# Altium project SSB23_rev0.PrjPCB
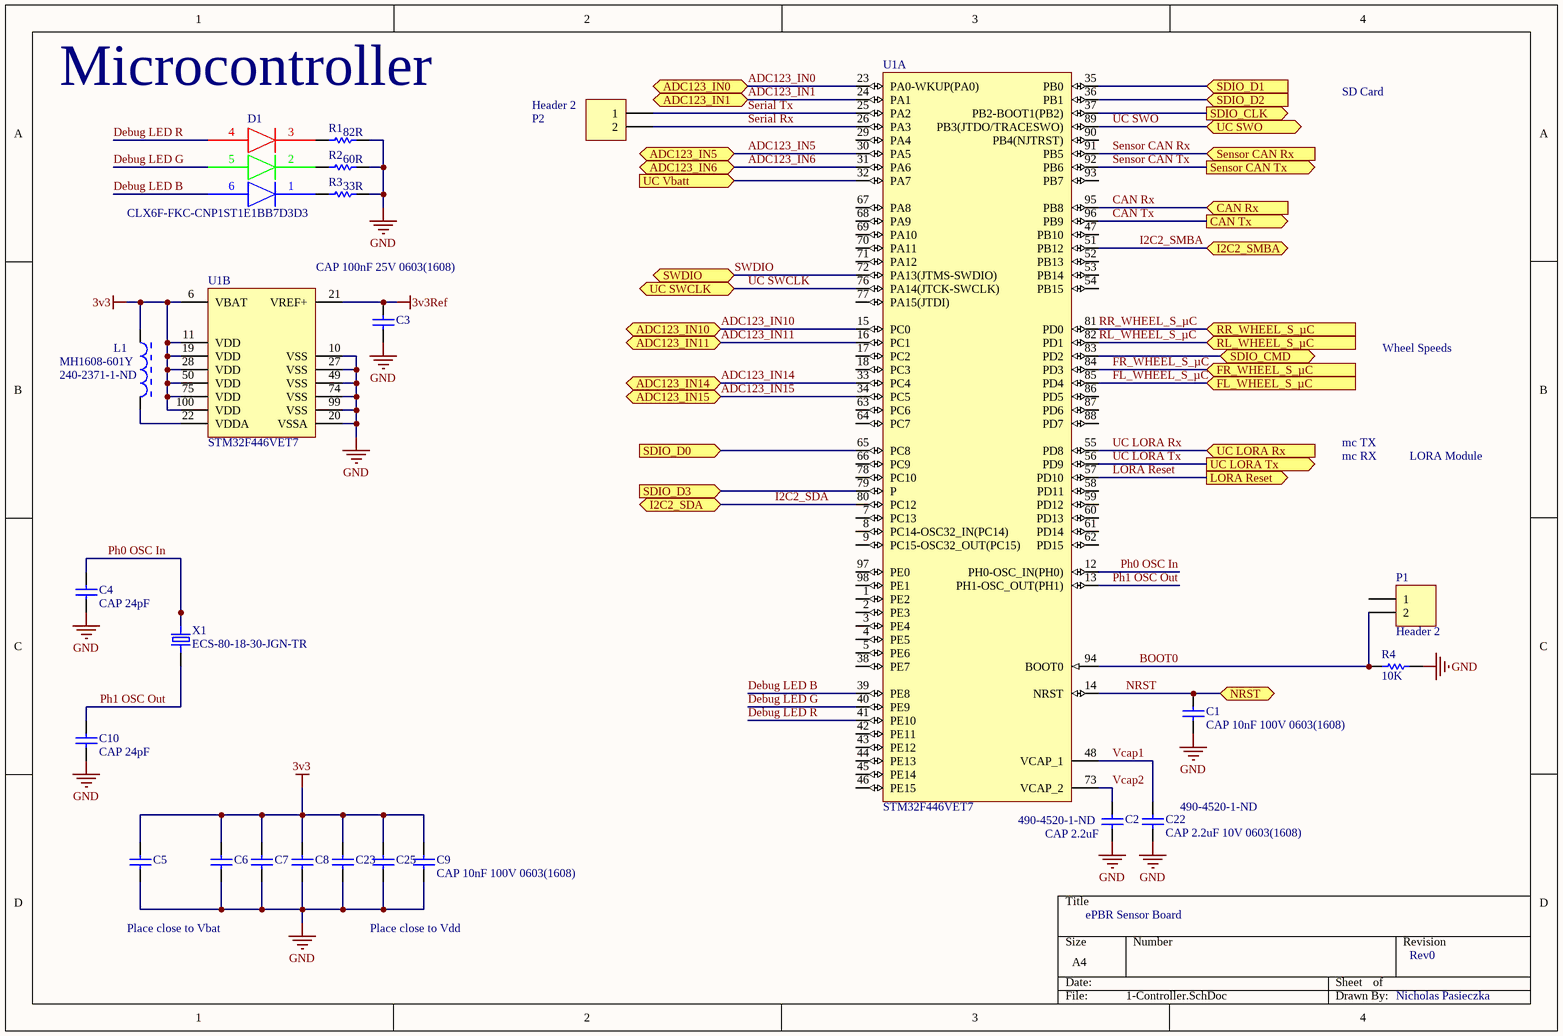
[diagram p0: 1-Controller.SchDoc]
8 sheets, 91 parts. Net scope: flat (ports and power ports of the same name join across sheets).
Board file: SSB23_rev0.PcbDoc
Sheets:
  1-Controller.SchDoc
  2-Power.SchDoc
  3-CAN.SchDoc
  4-Connector.SchDoc
  5-LORA.SchDoc
  6-Sensors.SchDoc
  7-Fusing.SchDoc
  8-Other_Inputs.SchDoc

## Sheet 1-Controller.SchDoc
size A4

### Parts
C1  CAP 10nF 100V 0603(1608)  [CAPC0603(1608)100_M]
C2  CAP 2.2uF  Supplier Part Number 1: 490-4520-1-ND  [CAPC0603(1608)55_N]
C3  CAP 100nF 25V 0603(1608)  [CAPC0603(1608)100_N]
C4  CAP 24pF  [CAPC0603(1608)100_N]
C5  CAP 10nF 100V 0603(1608)  [CAPC0603(1608)100_M]  (value not drawn)
C6  CAP 10nF 100V 0603(1608)  [CAPC0603(1608)100_M]  (value not drawn)
C7  CAP 10nF 100V 0603(1608)  [CAPC0603(1608)100_M]  (value not drawn)
C8  CAP 10nF 100V 0603(1608)  [CAPC0603(1608)100_M]  (value not drawn)
C9  CAP 10nF 100V 0603(1608)  [CAPC0603(1608)100_M]
C10  CAP 24pF  [CAPC0603(1608)100_N]
C22  CAP 2.2uF 10V 0603(1608)  Supplier Part Number 1: 490-4520-1-ND  [CAPC0603(1608)55_N]
C23  CAP 10nF 100V 0603(1608)  [CAPC0603(1608)100_M]  (value not drawn)
C25  CAP 10nF 100V 0603(1608)  [CAPC0603(1608)100_M]  (value not drawn)
D1  CLX6F-FKC-CNP1ST1E1BB7D3D3  [CLX6C-FKB]
L1  MH1608-601Y  Supplier Part Number 1: 240-2371-1-ND  [BOUR-MH1608_V]
P1  Header 2  [HDR1X2]
P2  Header 2  [HDR1X2]
R1  82R  [RESC0603(1608)_N]
R2  60R  [RESC0603(1608)_N]
R3  33R  [RESC0603(1608)_N]
R4  10K  [RESC0603(1608)_N]
U1  STM32F446VET7  [STM-LQFP100_L]  (parts A,B of 2)
X1  ECS-80-18-30-JGN-TR  [XTAL_ECS-80-18-30-JGN-TR]

### Ports
ADC123_IN0 (bidir), ADC123_IN1 (bidir), ADC123_IN5 (bidir), ADC123_IN6 (bidir), ADC123_IN10 (bidir), ADC123_IN11 (bidir), ADC123_IN14 (bidir), ADC123_IN15 (bidir), CAN Rx (in), CAN Tx (out), FL_WHEEL_S_µC (in), FR_WHEEL_S_µC (in), I2C2_SDA (bidir), I2C2_SMBA (bidir), LORA Reset (out), NRST (bidir), RL_WHEEL_S_µC (in), RR_WHEEL_S_µC (in), SDIO_CLK (out), SDIO_CMD (bidir), SDIO_D0 (in), SDIO_D1 (in), SDIO_D2 (in), SDIO_D3 (in), Sensor CAN Rx (in), Sensor CAN Tx (out), SWDIO (bidir), UC LORA Rx (in), UC LORA Tx (out), UC SWCLK (bidir), UC SWO (bidir), UC Vbatt (in)

### Nets
3v3: C5.2 C6.2 C7.2 C8.2 C9.2 C23.2 C25.2 L1.1 U1.6(VBAT) U1.11(VDD) U1.19(VDD) U1.28(VDD) U1.50(VDD) U1.75(VDD) U1.100(VDD)
3v3Ref: C3.2 U1.21(VREF+)
GND: C1.1 C2.1 C3.1 C4.1 C5.1 C6.1 C7.1 C8.1 C9.1 C10.1 C22.1 C23.1 C25.1 R1.2 R2.2 R3.2 R4.2 U1.10(VSS) U1.20(VSSA) U1.27(VSS) U1.49(VSS) U1.74(VSS) U1.99(VSS)
ADC123_IN0: U1.23(PA0-WKUP(PA0)) ; port ADC123_IN0
ADC123_IN1: U1.24(PA1) ; port ADC123_IN1
ADC123_IN5: U1.30(PA5) ; port ADC123_IN5
ADC123_IN6: U1.31(PA6) ; port ADC123_IN6
ADC123_IN10: U1.15(PC0) ; port ADC123_IN10
ADC123_IN11: U1.16(PC1) ; port ADC123_IN11
ADC123_IN14: U1.33(PC4) ; port ADC123_IN14
ADC123_IN15: U1.34(PC5) ; port ADC123_IN15
BOOT0: P1.2 R4.1 U1.94(BOOT0)
CAN Rx: U1.95(PB8) ; port CAN Rx
CAN Tx: U1.96(PB9) ; port CAN Tx
Debug LED B: D1.6(B) U1.39(PE8)
Debug LED G: D1.5(G) U1.40(PE9)
Debug LED R: D1.4(R) U1.41(PE10)
FL_WHEEL_S_µC: U1.85(PD4) ; port FL_WHEEL_S_µC
FR_WHEEL_S_µC: U1.84(PD3) ; port FR_WHEEL_S_µC
I2C2_SDA: U1.80(PC12) ; port I2C2_SDA
I2C2_SMBA: U1.51(PB12) ; port I2C2_SMBA
LORA Reset: U1.57(PD10) ; port LORA Reset
NRST: C1.2 U1.14(NRST) ; port NRST
Ph0 OSC In: C4.2 U1.12(PH0-OSC_IN(PH0)) X1.2(OUT/IN)
Ph1 OSC Out: C10.2 U1.13(PH1-OSC_OUT(PH1)) X1.1(IN/OUT)
RL_WHEEL_S_µC: U1.82(PD1) ; port RL_WHEEL_S_µC
RR_WHEEL_S_µC: U1.81(PD0) ; port RR_WHEEL_S_µC
Sensor CAN Rx: U1.91(PB5) ; port Sensor CAN Rx
Sensor CAN Tx: U1.92(PB6) ; port Sensor CAN Tx
Serial Rx: P2.2 U1.26(PA3)
Serial Tx: P2.1 U1.25(PA2)
SWDIO: U1.72(PA13(JTMS-SWDIO)) ; port SWDIO
UC LORA Rx: U1.55(PD8) ; port UC LORA Rx
UC LORA Tx: U1.56(PD9) ; port UC LORA Tx
UC SWCLK: U1.76(PA14(JTCK-SWCLK)) ; port UC SWCLK
UC SWO: U1.89(PB3(JTDO/TRACESWO)) ; port UC SWO
UC Vbatt: U1.32(PA7) ; port UC Vbatt
Vcap1: C22.2 U1.48(VCAP_1)
Vcap2: C2.2 U1.73(VCAP_2)
NetCN1_1: U1.83(PD2) ; port SDIO_CMD
NetCN1_2: U1.79(P) ; port SDIO_D3
NetCN1_3: U1.65(PC8) ; port SDIO_D0
NetCN1_4: U1.35(PB0) ; port SDIO_D1
NetCN1_5: U1.36(PB1) ; port SDIO_D2
NetCN1_6: U1.37(PB2-BOOT1(PB2)) ; port SDIO_CLK
NetD1_1: D1.1(B) R3.1
NetD1_2: D1.2(G) R2.1
NetD1_3: D1.3(R) R1.1
NetL1_2: L1.2 U1.22(VDDA)

Not connected (* = marked no-connect by the designer): P1 1; U1 1(PE2) 2(PE3) 3(PE4) 4(PE5) 5(PE6) 7(PC13) 8(PC14-OSC32_IN(PC14)) 9(PC15-OSC32_OUT(PC15)) 17(PC2) 18(PC3) 29(PA4) 38(PE7) 42(PE11) 43(PE12) 44(PE13) 45(PE14) 46(PE15) 47(PB10) 52(PB13) 53(PB14) 54(PB15) 58(PD11) 59(PD12) 60(PD13) 61(PD14) 62(PD15) 63(PC6) 64(PC7) 66(PC9) 67(PA8) 68(PA9) 69(PA10) 70(PA11) 71(PA12) 77(PA15(JTDI)) 78(PC10) 86(PD5) 87(PD6) 88(PD7) 90(PB4(NJTRST)) 93(PB7) 97(PE0) 98(PE1)

### Notes on the sheet
- Microcontroller
- SD Card
- Wheel Speeds
- mc TX
- mc RX
- LORA Module
- ePBR Sensor Board
- Place close to Vbat
- Place close to Vdd
- Rev0
- Nicholas Pasieczka

### Library data of the parts
C1 C5-C9 C23 C25 = CMP-1035-02326-1: CAP 10nF 100V ±20% 0603 (1608 Metric) Thickness 1mm SMD; Case-EIA: 0603; Tolerance: Â±20%; Case-Metric: 1608; Max Thickness: 1 mm; Technology: SMT; Value: 10nF; Rated Voltage: 100 V
C2 C22 = CMP-1035-02757-1: CAP 2.2uF 10V ±10% 0603 (1608 Metric) Thickness 0.55mm SMD; Case-EIA: 0603; Case-Metric: 1608; Tolerance: Â±10%; Value: 2.2uF; Rated Voltage: 10 V; Technology: SMT; Max Thickness: 0.55 mm; Supplier 1: Digi-Key
C3 = CMP-1035-02589-1: CAP 100nF 25V ±20% 0603 (1608 Metric) Thickness 1mm SMD; Case-EIA: 0603; Tolerance: Â±20%; Case-Metric: 1608; Value: 100nF; Max Thickness: 1 mm; Technology: SMT; Rated Voltage: 25 V
C4 C10 = CMP-1035-00843-1: CAP 24pF 16V ±2% 0603 (1608 Metric) Thickness 1mm SMD; Tolerance: Â±2%; Case-Metric: 1608; Case-EIA: 0603; Value: 24pF; Technology: SMT; Rated Voltage: 16 V; Max Thickness: 1 mm
D1 = LED - CLX6F-FKC-CNP1ST1E1BB7D3D3: Red, Green, Blue (RGB) 622nm Red, 530nm Green, 470nm Blue LED Indication - Discrete 2.1V Red, 2.7V Green, 3V Blue 6-SMD, J-Lead; ComponentLink1Description: Digikey; ComponentLink1URL: https://www.digikey.ca/product-detail/en/cree-inc/CLX6F-FKC-CNP1ST1E1BB7D3D3/CLX6F-FKC-CNP1ST1E1BB7D3D3CT-ND/6362814
L1 = CMP-2000-06698-1: Chip Bead, 600 Ohm, 1 A, -55 to 125 degC, 2-Pin SMD (0603), RoHS, Tape and Reel; Manufacturer: Bourns; Impedance @ Frequency: 600Ohm@100MHz; Online Catalog: MHSeries; DC Resistance (DCR) (Max): 200mOhm; Current Rating (Max): 1A; Other Names: MH1608-601YCT; EDA / CAD Models: DownloadfromAcceleratedDesigns; Filter Type: Power,SignalLine; Number of Lines: 1; Mounting Type: SurfaceMount; Manufacturer URL: http://www.bourns.com/; Package Description: 2-Pin Surface Mount Device, Body 1.6 x 0.8 mm; Category: Filters; Packaging: CutTape(CT); Family: FerriteBeadsandChips; Datasheet Version: 03/2015; Standard Package: 1; Mounting Technology: SurfaceMount; Package / Case: 0603(1608Metric); Datasheet URL: http://www.bourns.com/docs/Product-Datasheets/mh.pdf; Operating Temperature: -55°C~125°C; RoHS Information: MH1608SeriesMaterialDeclaration; Ratings: -; Package Reference: 0603; Series: MH; Supplier 1: Digi-Key
P1 P2 = Header 2: Header, 2-Pin; LatestRevisionDate: 17-Jul-2002; LatestRevisionNote: Re-released for DXP Platform.; Publisher: Altium Limited
R1 = CMP-1012-00048-1: 82R 0.1W 5% 0603 (1608 Metric)  SMD; Case-Metric: 1608; Value: 82.00 Ohm; Case-EIA: 0603; Technology: SMT; Tolerance: 5 %; Power: 0.1 W
R2 = CMP-1012-00372-1: 60R4 0.1W 1% 0603 (1608 Metric)  SMD; Case-EIA: 0603; Value: 60.40 Ohm; Case-Metric: 1608; Technology: SMT; Tolerance: 1 %; Power: 0.1 W
R3 = CMP-1012-00038-1: 33R 0.1W 5% 0603 (1608 Metric)  SMD; Value: 33.00 Ohm; Case-EIA: 0603; Case-Metric: 1608; Tolerance: 5 %; Technology: SMT; Power: 0.1 W
R4 = CMP-1012-00098-1: 10K 0.1W 5% 0603 (1608 Metric)  SMD; Case-EIA: 0603; Value: 10000.00 Ohm; Case-Metric: 1608; Technology: SMT; Tolerance: 5 %; Power: 0.1 W
U1 = CMP-0243-00221-1: ARM Cortex-M4 32-bit MCU+FPU, 512 KB Flash, 128 KB Internal RAM, 81 I/Os, 100-Pin LQFP, -40 to 105 degC, Tray; Supply Voltage(Vcc) min (V): 1.7; Operating Frequency(F) (Processor speed) (MHz): 180; D/A Converter: 2; FLASH Size (Prog) (kB): 512; I/Os (High Current): 81; Internal RAM Size (kB): 128; Core: ARM Cortex-M4; Packing: Tray; ComponentLink1URL: http://www.st.com/; DatasheetVersion: Rev. 6; Mounting Technology: Surface Mount; ComponentLink2Description: Datasheet; ComponentLink2URL: http://www.st.com/st-web-ui/static/active/en/resource/technical/document/datasheet/DM00141306.pdf; Package Reference: 100-Pin Low Profile Quad Flat Package, Body 14 x 14 mm, Pitch 0.5 mm; ComponentLink1Description: Manufacturer URL; Package Description: LQFP100; PartId: 1
X1 = ECS-80-18-30-JGN-TR: 8MHz Â±20ppm Crystal 18pF 100 Ohms 2-SMD, No Lead; MF: ECS Inc.; Digi-Key_Part_Number: XC2103CT-ND; Digi-Key_Purchase_URL: https://www.digikey.com/product-detail/en/ecs-inc/ECS-80-18-30-JGN-TR/XC2103CT-ND/5875587?utm_source=snapeda&utm_medium=aggregator&utm_campaign=symbol; SnapEDA_Link: https://www.snapeda.com/parts/ECS-80-18-30-JGN-TR/ECS%20Inc./view-part/2121425/?ref=snap; Package: SMD-2 ECS International; MP: ECS-80-18-30-JGN-TR; Value: *

## Sheet 2-Power.SchDoc
size A4
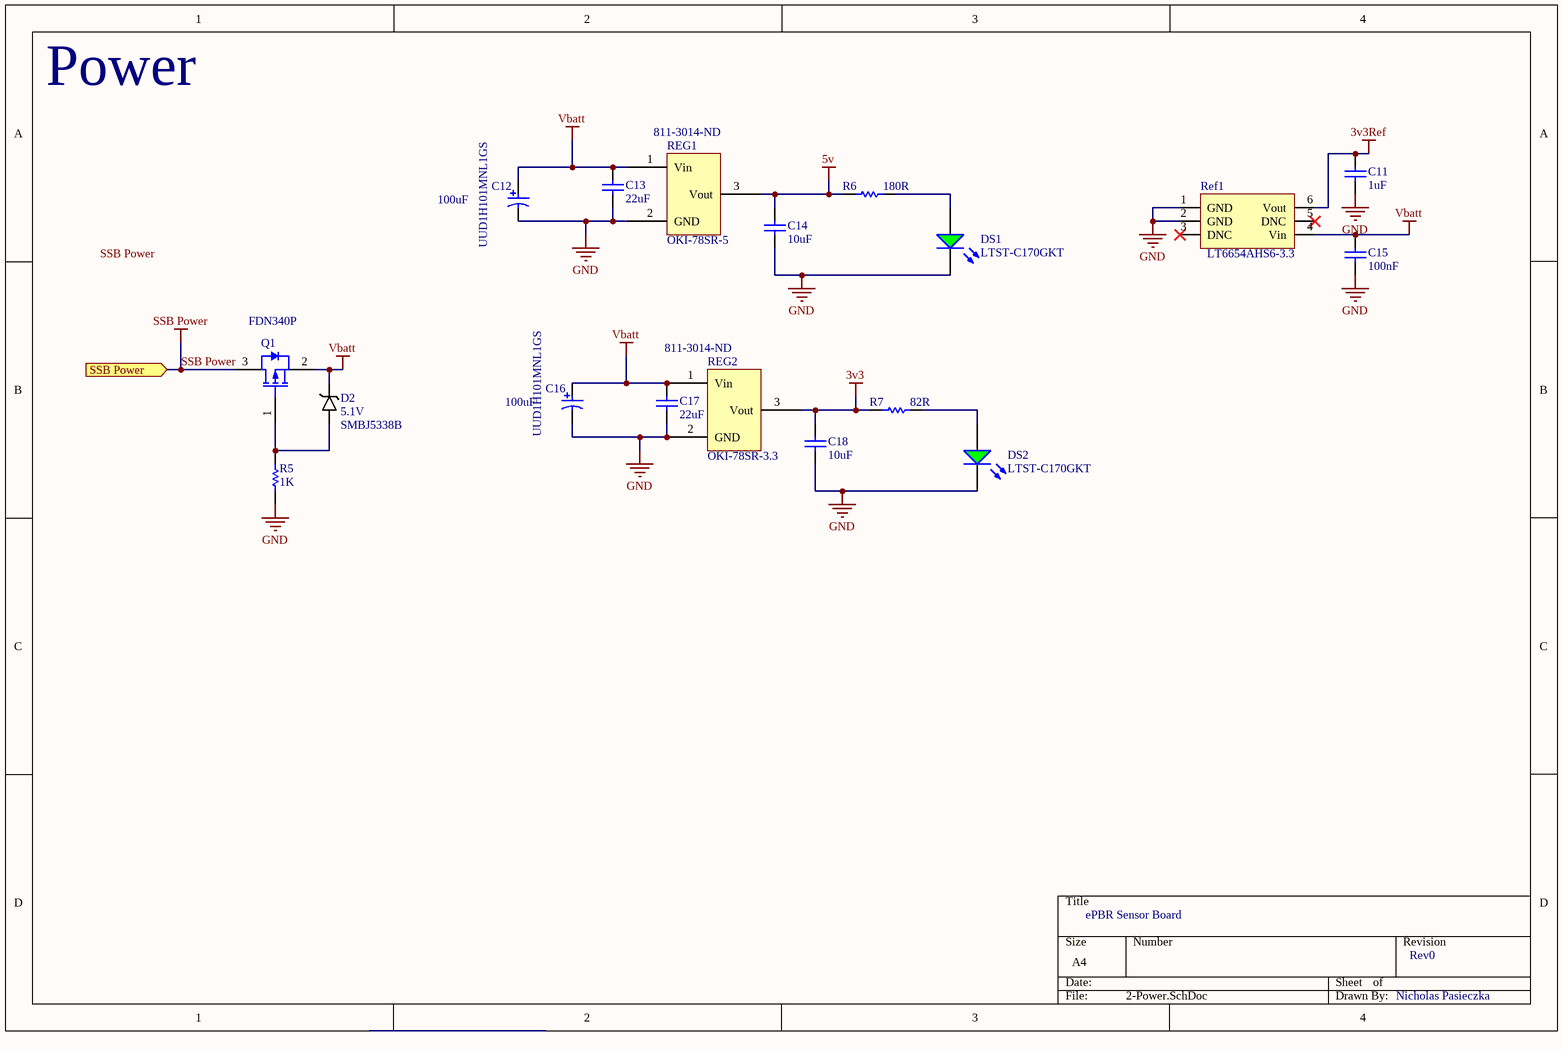
[diagram p1: 2-Power.SchDoc]

### Parts
C11  value 1uF  [1608[0603]]  (hidden comment: Cap)
C12  UUD1H101MNL1GS  [NIC-CAPA2-8X10_V]
C13  value 22uF  [C1210_M]  (hidden comment: Cap)
C14  value 10uF  [C1210_M]  (hidden comment: Cap)
C15  value 100nF  [1608[0603]]  (hidden comment: Cap)
C16  UUD1H101MNL1GS  [NIC-CAPA2-8X10_V]
C17  value 22uF  [C1210_M]  (hidden comment: Cap)
C18  value 10uF  [C1210_M]  (hidden comment: Cap)
D2  Reverse Voltage: 5.1V  Part Number: SMBJ5338B  [DO-214AA (SMB)]  (hidden comment: Zener Diode, 5.1V, 5W SMBJ5338B)
DS1  LTST-C170GKT  [LTST-C170GKT_V]
DS2  LTST-C170GKT  [LTST-C170GKT_V]
Q1  FDN340P  [FAIR-SSOT3L-3_V]
R5  value 1K  [1608[0603]]  (hidden comment: Res1)
R6  value 180R  [1608[0603]]  (hidden comment: Res1)
R7  value 82R  [1608[0603]]  (hidden comment: Res1)
Ref1  LT6654AHS6-3.3  [TSOT-23 S6]
REG1  OKI-78SR-5  Supplier Part Number 2: 811-3014-ND  [OKI-78SR-5/1.5-W - Horizontal]
REG2  OKI-78SR-3.3  Supplier Part Number 2: 811-3014-ND  [Reg - TH, 3 pin, 100 mil Pitch, VTL]

### Ports
SSB Power (in)

### Nets
3v3: C18.2 R7.1 REG2.3(Vout)
3v3Ref: C11.2 Ref1.6(Vout)
5v: C14.2 R6.1 REG1.3(Vout)
GND: C11.1 C12.2 C13.1 C14.1 C15.1 C16.2 C17.1 C18.1 DS1.2(K) DS2.2(K) R5.1 Ref1.1(GND) Ref1.2(GND) REG1.2(GND) REG2.2(GND)
SSB Power: Q1.3(DRAIN) ; port SSB Power
Vbatt: C12.1 C13.2 C15.2 C16.1 C17.2 D2.K Q1.2(SOURCE) Ref1.4(Vin) REG1.1(Vin) REG2.1(Vin)
NetD2_A: D2.A Q1.1(GATE) R5.2
NetDS1_1: DS1.1(A) R6.2
NetDS2_1: DS2.1(A) R7.2

Not connected (* = marked no-connect by the designer): Ref1 3(DNC)* 5(DNC)*

### Notes on the sheet
- Power
- (near C12) 100uF
- (near C16) 100uF
- ePBR Sensor Board
- Rev0
- Nicholas Pasieczka
- Labels drawn without touching a wire or pin: SSB Power

### Library data of the parts
C11 = Cap: Capacitor; Manufacturer: Murata Electronics North America; Manufacturer Part Number: GRM188R61E105KA12D; Capacitance: 1µF; Tolerance: ±10%; Voltage - Rated: 25V; Temperature Coefficient: X5R; Supplier 1: Digi-Key; Supplier Part Number 1: 490-3897-1-ND; RoHS: RoHS Compliant; Category: Capacitors; Stock 1: 4259407; Pricing 1: 1=0.15, 10=0.053, 50=0.0288, 100=0.0242, 250=0.01984, 500=0.01696, 1000=0.0132 (CAD); Packaging: Cut Tape (CT); Part Status: Active; Operating Temperature: -55°C ~ 85°C; Features: -; Ratings: -; Applications: General Purpose; Mounting Type: Surface Mount, MLCC; Package / Case: 0603 (1608 Metric); Size / Dimension: 0.063" L x 0.031" W (1.60mm x 0.80mm); Height - Seated (Max): -; Thickness (Max): 0.035" (0.90mm); Lead Spacing: -; Lead Style: -; ComponentLink1URL: http://www.murata.com/~/media/webrenewal/support/library/catalog/products/capacitor/mlcc/c02e.pdf; ComponentLink1Description: http://www.murata.com/~/media/webrenewal/support/library/catalog/products/capacitor/mlcc/c02e.pdf
C12 C16 = CMP-0687-00073-1: Aluminum Electrolytic Capacitor, UD Series, Low Impedance, 100 uF, 50 V, + / - 20%, -55 to 105 degC, Chip Type, 8 x 10 mm D x L, Pb-Free, Reel; Manufacturer: Nichicon; Rated Ripple Current (at 100kHz): 300 mA; Tolerance Rated Capacitance: -20 to 20%; Packing: Dia382mm Reel; Impedance: 0.34 Ohm; Rated Voltage: 50 V; Endurance Time: 5000 h; Rated Capacitance: 100 uF; Capacitance: 100µF; Voltage Rating: 50V; Lifetime @ Temp.: 5000 Hrs @ 105°C; Polarization: Polar; Ripple Current: 300mA; Surface Mount Land Size: 0.327" L x 0.327" W (8.30mm x 8.30mm); ComponentLink3Description: Package Specification; ComponentLink2Description: Datasheet; PackageReference: CAPAE-D8H10; RoHS: TRUE; Length: 10 mm; Mounting Technology: Surface Mount; PackageDescription: 2-Pin Surface Mount Device, Diameter 8 mm, Height 10 mm, Pitch 6.5 mm; DatasheetVersion: 08/2012; Diameter: 8 mm; ComponentLink3URL: http://products.nichicon.co.jp/en/pdf/XJA043/e-ud.pdf; ComponentLink1Description: Manufacturer URL; PartNumber: UUD1H101MNL1GS; ComponentLink2URL: http://products.nichicon.co.jp/en/pdf/XJA043/e-ud.pdf; ComponentLink1URL: http://www.nichicon.co.jp/; Supplier 1: Digi-Key; Supplier Part Number 1: 493-2306-1-ND; Manufacturer Part Number: UUD1H101MNL1GS; Category: Capacitors; Stock 1: 65948; Pricing 1: 1=0.92, 10=0.685, 25=0.5868, 50=0.5478, 100=0.4696, 250=0.43044 (CAD); Packaging: Cut Tape (CT); Part Status: Active; Tolerance: ±20%; ESR (Equivalent Series Resistance): -; Operating Temperature: -55°C ~ 105°C; Applications: General Purpose; Lead Spacing: -; Size / Dimension: 0.315" Dia (8.00mm); Height - Seated (Max): 0.394" (10.00mm); Mounting Type: Surface Mount; Package / Case: Radial, Can - SMD; ComponentLink4URL: http://nichicon-us.com/english/products/pdfs/e-uud.pdf; ComponentLink4Description: http://nichicon-us.com/english/products/pdfs/e-uud.pdf
C13 C17 = Cap: Capacitor; Manufacturer: Yageo; Manufacturer Part Number: CC1210MKX5R8BB226; Capacitance: 22µF; Tolerance: ±20%; Voltage - Rated: 25V; Temperature Coefficient: X5R; Supplier 1: Digi-Key; Supplier Part Number 1: 311-2056-1-ND; RoHS: RoHS Compliant; Category: Capacitors; Stock 1: 128; Pricing 1: 1=1, 10=0.703, 25=0.5996, 50=0.5314, 100=0.4628, 250=0.39424 (CAD); Packaging: Cut Tape (CT); Part Status: Active; Operating Temperature: -55°C ~ 85°C; Features: -; Ratings: -; Applications: General Purpose; Failure Rate: -; Mounting Type: Surface Mount, MLCC; Package / Case: 1210 (3225 Metric); Size / Dimension: 0.126" L x 0.098" W (3.20mm x 2.50mm); Height - Seated (Max): -; Thickness (Max): 0.110" (2.80mm); Lead Spacing: -; Lead Style: -; ComponentLink1URL: http://www.yageo.com/documents/recent/UPY-GPHC_X5R_4V-to-50V_23.pdf; ComponentLink1Description: http://www.yageo.com/documents/recent/UPY-GPHC_X5R_4V-to-50V_23.pdf
C14 C18 = Cap: Capacitor; Manufacturer: Yageo; Manufacturer Part Number: CC1210ZKY5V8BB106; Capacitance: 10µF; Tolerance: -20%, +80%; Voltage - Rated: 25V; Temperature Coefficient: Y5V (F); Supplier 1: Digi-Key; Supplier Part Number 1: 311-2063-1-ND; RoHS: RoHS Compliant; Category: Capacitors; Stock 1: 1156; Pricing 1: 1=0.47, 10=0.323, 25=0.258, 50=0.2154, 100=0.1829, 250=0.14528, 500=0.12912, 1000=0.11298 (CAD); Packaging: Cut Tape (CT); Part Status: Active; Operating Temperature: -30°C ~ 85°C; Features: -; Ratings: -; Applications: General Purpose; Failure Rate: -; Mounting Type: Surface Mount, MLCC; Package / Case: 1210 (3225 Metric); Size / Dimension: 0.126" L x 0.098" W (3.20mm x 2.50mm); Height - Seated (Max): -; Thickness (Max): 0.083" (2.10mm); Lead Spacing: -; Lead Style: -; ComponentLink1URL: http://www.yageo.com/documents/recent/UPY-GPHC_Y5V_6.3V-to-50V_7.pdf; ComponentLink1Description: http://www.yageo.com/documents/recent/UPY-GPHC_Y5V_6.3V-to-50V_7.pdf
C15 = Cap: Capacitor; Manufacturer: Yageo; Manufacturer Part Number: CC0603KRX7R9BB104; Capacitance: 0.10µF; Tolerance: ±10%; Voltage - Rated: 50V; Temperature Coefficient: X7R; Supplier 1: Digi-Key; Supplier Part Number 1: 311-1344-1-ND; RoHS: RoHS Compliant; Category: Capacitors; Stock 1: 4016262; Pricing 1: 1=0.15, 10=0.043, 25=0.0312, 50=0.0232, 100=0.0189, 250=0.0158, 500=0.01346, 1000=0.01059 (CAD); Packaging: Cut Tape (CT); Part Status: Active; Operating Temperature: -55°C ~ 125°C; Features: -; Ratings: -; Applications: General Purpose; Failure Rate: -; Mounting Type: Surface Mount, MLCC; Package / Case: 0603 (1608 Metric); Size / Dimension: 0.063" L x 0.031" W (1.60mm x 0.80mm); Height - Seated (Max): -; Thickness (Max): 0.035" (0.90mm); Lead Spacing: -; Lead Style: -; ComponentLink1URL: http://www.yageo.com/documents/recent/UPY-GPHC_X7R_6.3V-to-50V_16.pdf; ComponentLink1Description: http://www.yageo.com/documents/recent/UPY-GPHC_X7R_6.3V-to-50V_16.pdf
DS1 DS2 = CMP-1674-00002-5: LED Uni-Color Green, 100 mW, 120 mA, -55 to 85 degC, 2-Pin SMD, RoHS, Tape and Reel; Manufacturer: Lite-On; Lens Color: Colorless; Lens Transparency: Clear; Millicandela Rating: 6mcd; Lens Style/Size: Rectangle with Flat Top, 1.40mm x 1.25mm; Voltage - Forward (Vf) (Typ): 2.1V; Current - Test: 10mA; Viewing Angle: 130°; Wavelength - Dominant: 569nm; Wavelength - Peak: 565nm; ComponentLink1URL: http://www.us.liteon.com/; Height: 1.1 mm; PackageDescription: 2-Pin Surface Mount Device, Body 2 x 1.25 mm; RoHSCompliant: true; Package Quantity: 1; Packaging: Tape and Reel; Mount: Surface Mount; Min Operating Temperature: -55 degC; DatasheetVersion: 03/2003; Max Operating Temperature: 85 degC; ComponentLink1Description: Manufacturer URL; Pins: 2; Mounting Technology: Surface Mount; Length: 2 mm; Colour: Green; PackageReference: C170GKT; ComponentLink2URL: http://media.digikey.com/pdf/Data%20Sheets/Lite-On%20PDFs/LTST-C170GKT.pdf; ComponentLink2Description: Datasheet; Supplier 1: Digi-Key; Supplier Part Number 1: 160-1179-1-ND; Manufacturer Part Number: LTST-C170GKT; RoHS: RoHS Compliant; Category: Optoelectronics; Stock 1: 242288; Pricing 1: 1=0.48, 10=0.351, 25=0.2588, 100=0.1848, 250=0.12564, 500=0.11086, 1000=0.08684 (CAD); Part Status: Active; Color: Green; Mounting Type: Surface Mount; Features: -; Package / Case: 0805 (2012 Metric); Supplier Device Package: -; Size / Dimension: 2.00mm L x 1.25mm W; Height (Max): 1.10mm
Q1 = CMP-2100-03638-1: Single P-Channel, Logic Level, PowerTrench(R) MOSFET, 2 A, 20 V, -55 to 150 degC, 3-Pin SOT-23, RoHS, Tape and Reel; Manufacturer: Fairchild Semiconductor; Fall Time: 11ns; Current Rating: -2A; Turn-On Delay Time: 10ns; Drain to Source Breakdown Voltage: -20V; Drain to Source Resistance: 60mOhm; Gate to Source Voltage (Vgs): 8V; Threshold Voltage: -800mV; Rds On Max: 70mOhm; Package Version: Rev. 3, 05/2015; Turn-Off Delay Time: 27ns; Power Dissipation: 500mW; Number of Elements: 1; Drain to Source Voltage (Vdss): 20V; Rise Time: 9ns; Input Capacitance: 779pF; Continuous Drain Current (ID): 2A; Radiation Hardening: No; Contact Plating: Tin; Mount: SurfaceMount; REACH SVHC: NoSVHC; Manufacturer URL: https://www.fairchildsemi.com/; Width: 3.05mm; Height: 0.94mm; Voltage Rating (DC): -20V; Package Quantity: 1; Case/Package: SOT-23; Package Reference: SSOT3L; Lead Free: LeadFree; Datasheet Version: Rev. E1, 02/2007; Termination: SMD/SMT; Package URL: https://www.fairchildsemi.com/package-drawings/MA/MA03B.pdf; Packaging: TapeandReel; Number of Pins: 3; RoHSCompliant: true; Datasheet URL: https://www.fairchildsemi.com/datasheets/FD/FDN340P.pdf; Max Operating Temperature: 150degC; Element Configuration: Single; Min Operating Temperature: -55degC; Length: 2.92mm; Package Description: 3-Pin Small Outline Transistor, Body 2.92 x 1.4 mm, Pitch 0.95 mm; Max Power Dissipation: 500mW
R5 = Res1: Resistor; Manufacturer: Panasonic Electronic Components; Manufacturer Part Number: ERJ-PA3F1001V; Tolerance: ±1%; Power (Watts): 0.25W, 1/4W; Temperature Coefficient: ±100ppm/°C; Supplier 1: Digi-Key; Supplier Part Number 1: P1.0KBYCT-ND; RoHS: RoHS Compliant; Category: Resistors; Stock 1: 56110; Pricing 1: 1=0.22, 10=0.198, 25=0.138, 50=0.1072, 100=0.0765, 250=0.05972, 500=0.04746, 1000=0.03368 (CAD); Packaging: Cut Tape (CT); Part Status: Active; Resistance (Ohms): 1k; Composition: Thick Film; Features: Automotive AEC-Q200, Pulse Withstanding; Operating Temperature: -55°C ~ 155°C; Package / Case: 0603 (1608 Metric); Supplier Device Package: 0603; Size / Dimension: 0.063" L x 0.031" W (1.60mm x 0.80mm); Height - Seated (Max): 0.022" (0.55mm); Number of Terminations: 2; Failure Rate: -; ComponentLink1URL: https://industrial.panasonic.com/cdbs/www-data/pdf/RDA0000/AOA0000C243.pdf; ComponentLink1Description: https://industrial.panasonic.com/cdbs/www-data/pdf/RDA0000/AOA0000C243.pdf
R6 = Res1: Resistor; Manufacturer: Yageo; Manufacturer Part Number: RC0603JR-07180RL; Resistance (Ohms): 180; Tolerance: ±5%; Power (Watts): 0.1W, 1/10W; Temperature Coefficient: ±100ppm/°C; Supplier 1: Digi-Key; Supplier Part Number 1: 311-180GRCT-ND; RoHS: RoHS Compliant; Category: Resistors; Stock 1: 201936; Pricing 1: 1=0.16, 10=0.016, 25=0.0112, 50=0.0084, 100=0.0062, 250=0.0048, 500=0.00382, 1000=0.00281 (CAD); Packaging: Cut Tape (CT); Part Status: Active; Composition: Thick Film; Features: Moisture Resistant; Operating Temperature: -55°C ~ 155°C; Package / Case: 0603 (1608 Metric); Supplier Device Package: 0603; Size / Dimension: 0.063" L x 0.031" W (1.60mm x 0.80mm); Height - Seated (Max): 0.022" (0.55mm); Number of Terminations: 2; Failure Rate: -; ComponentLink1URL: http://www.yageo.com/NewPortal/yageodocoutput?fileName=/pdf/R-Chip/PYu-RC_Group_51_RoHS_L_4.pdf; ComponentLink1Description: http://www.yageo.com/NewPortal/yageodocoutput?fileName=/pdf/R-Chip/PYu-RC_Group_51_RoHS_L_4.pdf
R7 = Res1: Resistor; Manufacturer: Yageo; Manufacturer Part Number: RC0603JR-0782RL; Resistance (Ohms): 82; Tolerance: ±5%; Power (Watts): 0.1W, 1/10W; Temperature Coefficient: ±100ppm/°C; Supplier 1: Digi-Key; Supplier Part Number 1: 311-82GRCT-ND; RoHS: RoHS Compliant; Category: Resistors; Stock 1: 72049; Pricing 1: 1=0.16, 10=0.016, 25=0.0112, 50=0.0084, 100=0.0062, 250=0.0048, 500=0.00382, 1000=0.00281 (CAD); Packaging: Cut Tape (CT); Part Status: Active; Composition: Thick Film; Features: Moisture Resistant; Operating Temperature: -55°C ~ 155°C; Package / Case: 0603 (1608 Metric); Supplier Device Package: 0603; Size / Dimension: 0.063" L x 0.031" W (1.60mm x 0.80mm); Height - Seated (Max): 0.022" (0.55mm); Number of Terminations: 2; Failure Rate: -; ComponentLink1URL: http://www.yageo.com/NewPortal/yageodocoutput?fileName=/pdf/R-Chip/PYu-RC_Group_51_RoHS_L_4.pdf; ComponentLink1Description: http://www.yageo.com/NewPortal/yageodocoutput?fileName=/pdf/R-Chip/PYu-RC_Group_51_RoHS_L_4.pdf
Ref1 = LT6654AHS6-3.3: Manufacturer: Linear Technology; Reference Type: Series; Output Type: Fixed; Voltage - Output (Min/Fixed): 3.3V; Current - Output: 10mA; Tolerance: ±0.05%; Temperature Coefficient: 10ppm/°C; Noise - 0.1Hz to 10Hz: 1.7ppmp-p; Noise - 10Hz to 10kHz: 2ppmrms; Voltage - Input: 3.8 V ~ 36 V; Current - Supply: 600µA; Manufacturer Part Number: LT6654AHS6-3.3; Digikey Part Number: LT6654AHS6-3.3#TRMPBFCT-ND; Digikey Link: http://www.digikey.com/product-detail/en/linear-technology/LT6654AHS6-3.3-TRMPBF/LT6654AHS6-3.3-TRMPBFCT-ND/2485839; Supplier 1: Digi-Key; Supplier Part Number 1: LT6654AHS6-3.3#TRMPBFCT-ND; RoHS: RoHS Compliant; Category: Integrated Circuits (ICs); Stock 1: 1315; Pricing 1: 1=9.53, 25=8.508, 100=5.5596, 250=5.1048 (CAD); Packaging: Cut Tape (CT); Part Status: Active; Voltage - Output (Max): -; Current - Cathode: -; Operating Temperature: -40°C ~ 125°C (TA); Mounting Type: Surface Mount; Package / Case: SOT-23-6 Thin, TSOT-23-6; Supplier Device Package: TSOT-23-6; ComponentLink1URL: http://www.linear.com/docs/29677; ComponentLink1Description: http://www.linear.com/docs/29677
REG1 = OKI-78SR-5: 5V DCDC; Manufacturer: Murata Power Solutions Inc.; Manufacturer Part Number: OKI-78SR-3.3/1.5-W36H-C; Power (Watts) - Manufacture Series: 5W; Number of Outputs: 1; Voltage - Input (Min): 7V; Voltage - Input (Max): 36V; Current - Output (Max): 1.5A; Efficiency: 85.5%; Supplier 1: Digi-Key; Supplier Part Number 1: 811-2196-5-ND; Supplier 2: Digi-Key; RoHS: RoHS Compliant; Category: Power Supplies - Board Mount; Stock 2: 4108; Pricing 2: 1=6.31, 5=6.248, 10=6.205, 25=6.1168, 50=5.9262, 100=5.5449, 250=5.28716 (CAD); Packaging: Tray; Part Status: Active; Type: Linear Regulator Replacement; Voltage - Output 1: 5V; Voltage - Output 2: -; Voltage - Output 3: -; Voltage - Isolation: -; Applications: ITE (Commercial); Features: SCP; Mounting Type: Through Hole; Package / Case: 3-SIP Module; Size / Dimension: 0.65" L x 0.41" W x 0.30" H (16.5mm x 10.4mm x 7.6mm); Operating Temperature: -40°C ~ 85°C; ComponentLink1URL: http://power.murata.com/data/power/oki-78sr.pdf; ComponentLink1Description: http://power.murata.com/data/power/oki-78sr.pdf
REG2 = OKI-78SR-5: 3.3V DCDC; Manufacturer: Murata Power Solutions Inc.; Manufacturer Part Number: OKI-78SR-3.3/1.5-W36H-C; Power (Watts) - Manufacture Series: 5W; Number of Outputs: 1; Voltage - Input (Min): 7V; Voltage - Input (Max): 36V; Current - Output (Max): 1.5A; Efficiency: 85.5%; Supplier 1: Digi-Key; Supplier Part Number 1: 811-2196-5-ND; Supplier 2: Digi-Key; RoHS: RoHS Compliant; Category: Power Supplies - Board Mount; Stock 2: 4108; Pricing 2: 1=6.31, 5=6.248, 10=6.205, 25=6.1168, 50=5.9262, 100=5.5449, 250=5.28716 (CAD); Packaging: Tray; Part Status: Active; Type: Linear Regulator Replacement; Voltage - Output 1: 3.3V; Voltage - Output 2: -; Voltage - Output 3: -; Voltage - Isolation: -; Applications: ITE (Commercial); Features: SCP; Mounting Type: Through Hole; Package / Case: 3-SIP Module; Size / Dimension: 0.65" L x 0.41" W x 0.30" H (16.5mm x 10.4mm x 7.6mm); Operating Temperature: -40°C ~ 85°C; ComponentLink1URL: http://power.murata.com/data/power/oki-78sr.pdf; ComponentLink1Description: http://power.murata.com/data/power/oki-78sr.pdf
D2 = Zener Diode, 5.1V, 5W SMBJ5338B: Power: 5W

## Sheet 3-CAN.SchDoc
size A4
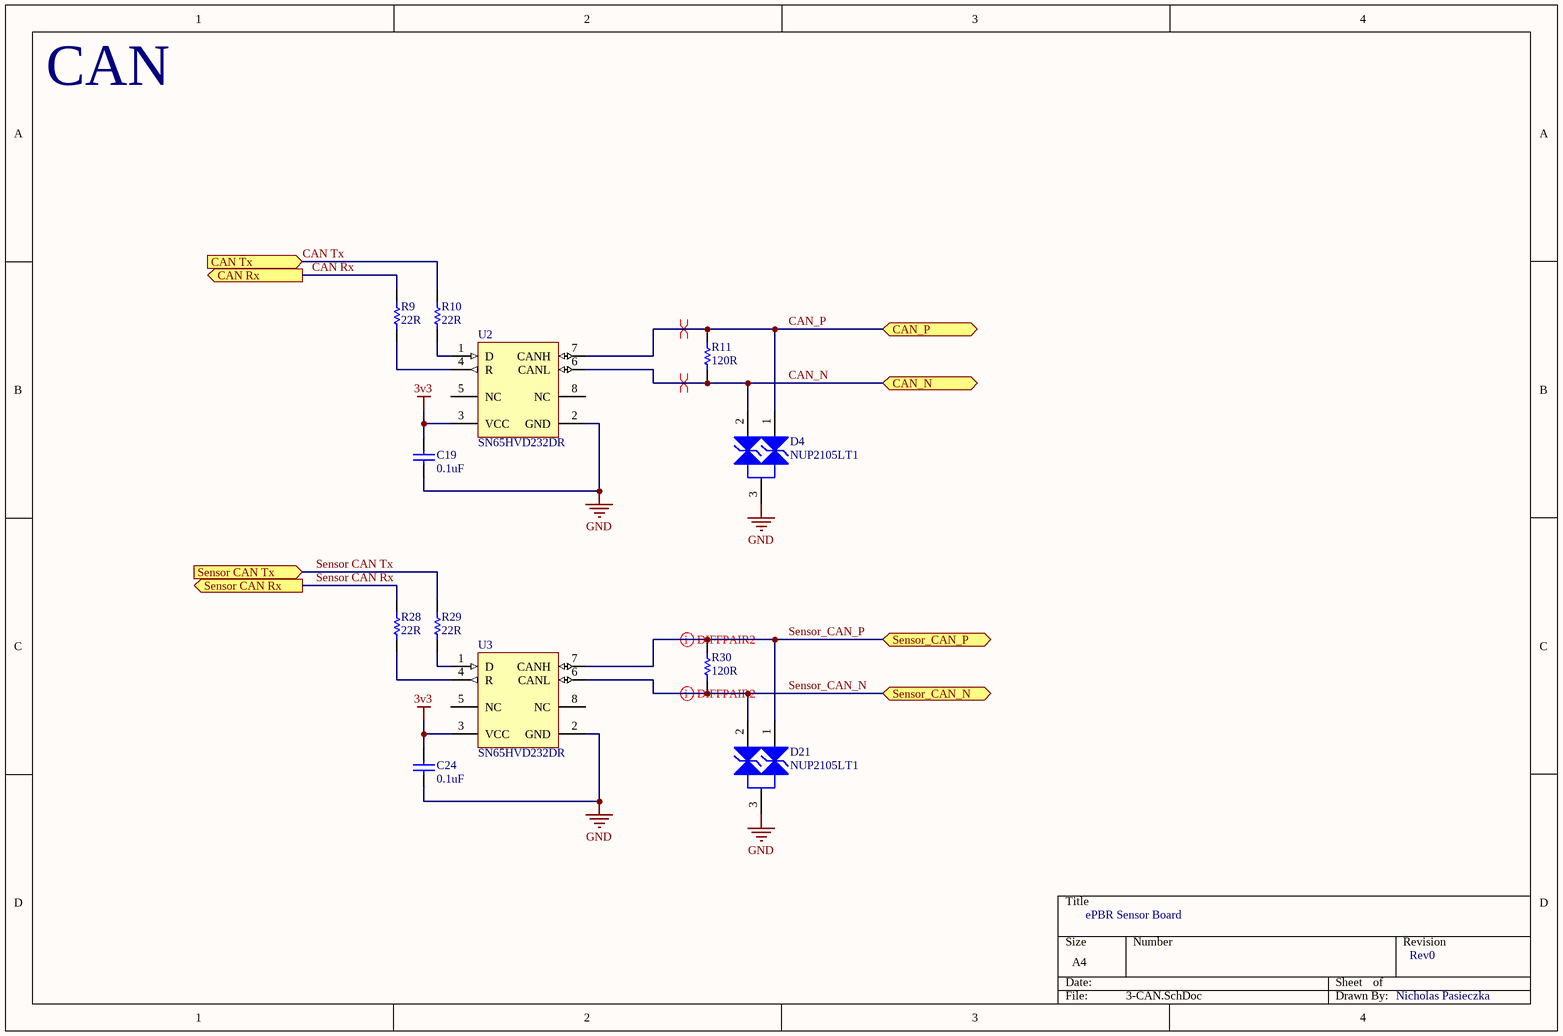
[diagram p2: 3-CAN.SchDoc]

### Parts
C19  0.1uF  [CAPC1608X90X30NL10T20]
C24  0.1uF  [CAPC1608X90X30NL10T20]
D4  NUP2105LT1  [ONSC-SOT-23-3-318-08_V]
D21  NUP2105LT1  [ONSC-SOT-23-3-318-08_V]
R9  22R  [RESC0603(1608)_N]
R10  22R  [RESC0603(1608)_N]
R11  120R  [RESC0603(1608)_N]
R28  22R  [RESC0603(1608)_N]
R29  22R  [RESC0603(1608)_N]
R30  120R  [RESC0603(1608)_N]
U2  SN65HVD232DR  [D0008A_M]
U3  SN65HVD232DR  [D0008A_M]

### Ports
CAN Rx (out), CAN Tx (in), CAN_N (bidir), CAN_P (bidir), Sensor CAN Rx (out), Sensor CAN Tx (in), Sensor_CAN_N (bidir), Sensor_CAN_P (bidir)

### Nets
3v3: C19.2 C24.2 U2.3(VCC) U3.3(VCC)
GND: C19.1 C24.1 D4.3(K) D21.3(K) U2.2(GND) U3.2(GND)
CAN Rx: R9.2 ; port CAN Rx
CAN Tx: R10.2 ; port CAN Tx
CAN_N: D4.2(K) R11.1 U2.6(CANL) ; port CAN_N
CAN_P: D4.1(K) R11.2 U2.7(CANH) ; port CAN_P
Sensor CAN Rx: R28.2 ; port Sensor CAN Rx
Sensor CAN Tx: R29.2 ; port Sensor CAN Tx
Sensor_CAN_N: D21.2(K) R30.1 U3.6(CANL) ; port Sensor_CAN_N
Sensor_CAN_P: D21.1(K) R30.2 U3.7(CANH) ; port Sensor_CAN_P
NetR9_1: R9.1 U2.4(R)
NetR10_1: R10.1 U2.1(D)
NetR28_1: R28.1 U3.4(R)
NetR29_1: R29.1 U3.1(D)

Not connected (* = marked no-connect by the designer): U2 5(NC) 8(NC); U3 5(NC) 8(NC)

### Layout directives
differential pair: CAN_N, CAN_P, Sensor_CAN_N, Sensor_CAN_P

### Notes on the sheet
- CAN
- ePBR Sensor Board
- Rev0
- Nicholas Pasieczka

### Library data of the parts
C19 C24 = CMP-2000-06092-1: Chip Capacitor, 100 nF, +/- 10%, 50 V, -55 to 125 degC, 0603 (1608 Metric), RoHS, Tape and Reel; Manufacturer: SamsungElectro-Mechanics; Product Length: 1.6mm; Voltage: 50Vdc; Product Height: 0.8mm; Rad Hard: No; Dielectric: X7R; Packaging: Tape&Reel; Package Description: 2-Pin Surface Mount Device, Body 1.60 x 0.80 mm; Package Reference: 0603; Datasheet Version: 06/2016; Operating Temperature: -55to125°C; Category: CapacitorCeramicMultilayer; Product Depth: 0.8mm; Mounting Technology: SurfaceMount; Package/Case: 0603; Capacitance Value: 0.1uF; Tolerance: 10%; Manufacturer URL: http://www.samsungsem.com/global/index.jsp; Construction: Flat; Mounting: SurfaceMount; Datasheet URL: http://www.samsungsem.com/kr/support/product-search/mlcc/__icsFiles/afieldfile/2016/08/18/S_CL10B104KB8SFNC.pdf
D4 D21 = CMP-1063-00165-1: Dual Line CAN Bus Protector, 3-Pin SOT-23, Tape and Reel; Manufacturer: On Semiconductor; PPK Max (W): 350; IR Max (uA): 0.1; Number of Lines: 2; V(BR) Min (V): 26.2; Direction: Bidirectional; C Max (pF): 30; PackageDescription: 3-Pin Small Outline Transistor, Body 2.92 x 1.3 mm, Pitch 0.95 mm; ComponentLink2URL: http://www.onsemi.cn/pub_link/Collateral/NUP2105L-D.PDF; ComponentLink3Description: Package Specification; ComponentLink2Description: Datasheet; ComponentLink1URL: http://www.onsemi.com/; Mounting Technology: Surface Mount; ComponentLink1Description: Manufacturer URL; Packing: Tape and Reel; PackageVersion: Rev. AP, 11/2009; PartNumber: NUP2105LT1; DatasheetVersion: Rev. 5; ComponentLink3URL: http://www.onsemi.cn/pub_link/Collateral/318-08.PDF; PackageReference: SOT-23-3-318-08
R9 R10 R28 R29 = CMP-1012-00034-1: 22R 0.1W 5% 0603 (1608 Metric)  SMD; Value: 22.00 Ohm; Case-EIA: 0603; Case-Metric: 1608; Technology: SMT; Power: 0.1 W; Tolerance: 5 %
R11 R30 = CMP-1012-00052-1: 120R 0.1W 5% 0603 (1608 Metric)  SMD; Case-EIA: 0603; Value: 120.00 Ohm; Case-Metric: 1608; Technology: SMT; Power: 0.1 W; Tolerance: 5 %
U2 U3 = CMP-0315-00075-2: 3.3 V Can Transceiver, 17 mA, -40 to 85 degC, 8-pin SOIC (D), Green (RoHS & no Sb/Br); Manufacturer: Texas Instruments; Supply Voltage(s)(V): 3.3; Receivers Per Package: 1; ICC(Max)(mA): 17; Rating: Catalog; Transient Pulse Protection(V): -25 to 25; Mounting Technology: Surface Mount; PartNumber: SN65HVD232DR; Code_JEDEC: MS-012AA; Eco-Plan: Green (RoHS & no Sb/Br); Isolated: No; SubFamily: CAN; Footprint: SN65HVD232; Drivers Per Package: 1; ComponentLink1URL: http://www.ti.com/general/docs/lit/getliterature.tsp?genericPartNumber=SN65HVD232&fileType=pdf; ComponentLink1Description: Datasheet; PackageDescription: 8-Pin Plastic Small Outline Integrated Circuit, 4.9 x 3.9 mm, Pitch 1.27 mm Pitch; PackageReference: D0008A; DatasheetVersion: SLOS346K; PackageVersion: revM, Jun-2011

## Sheet 4-Connector.SchDoc
size A4
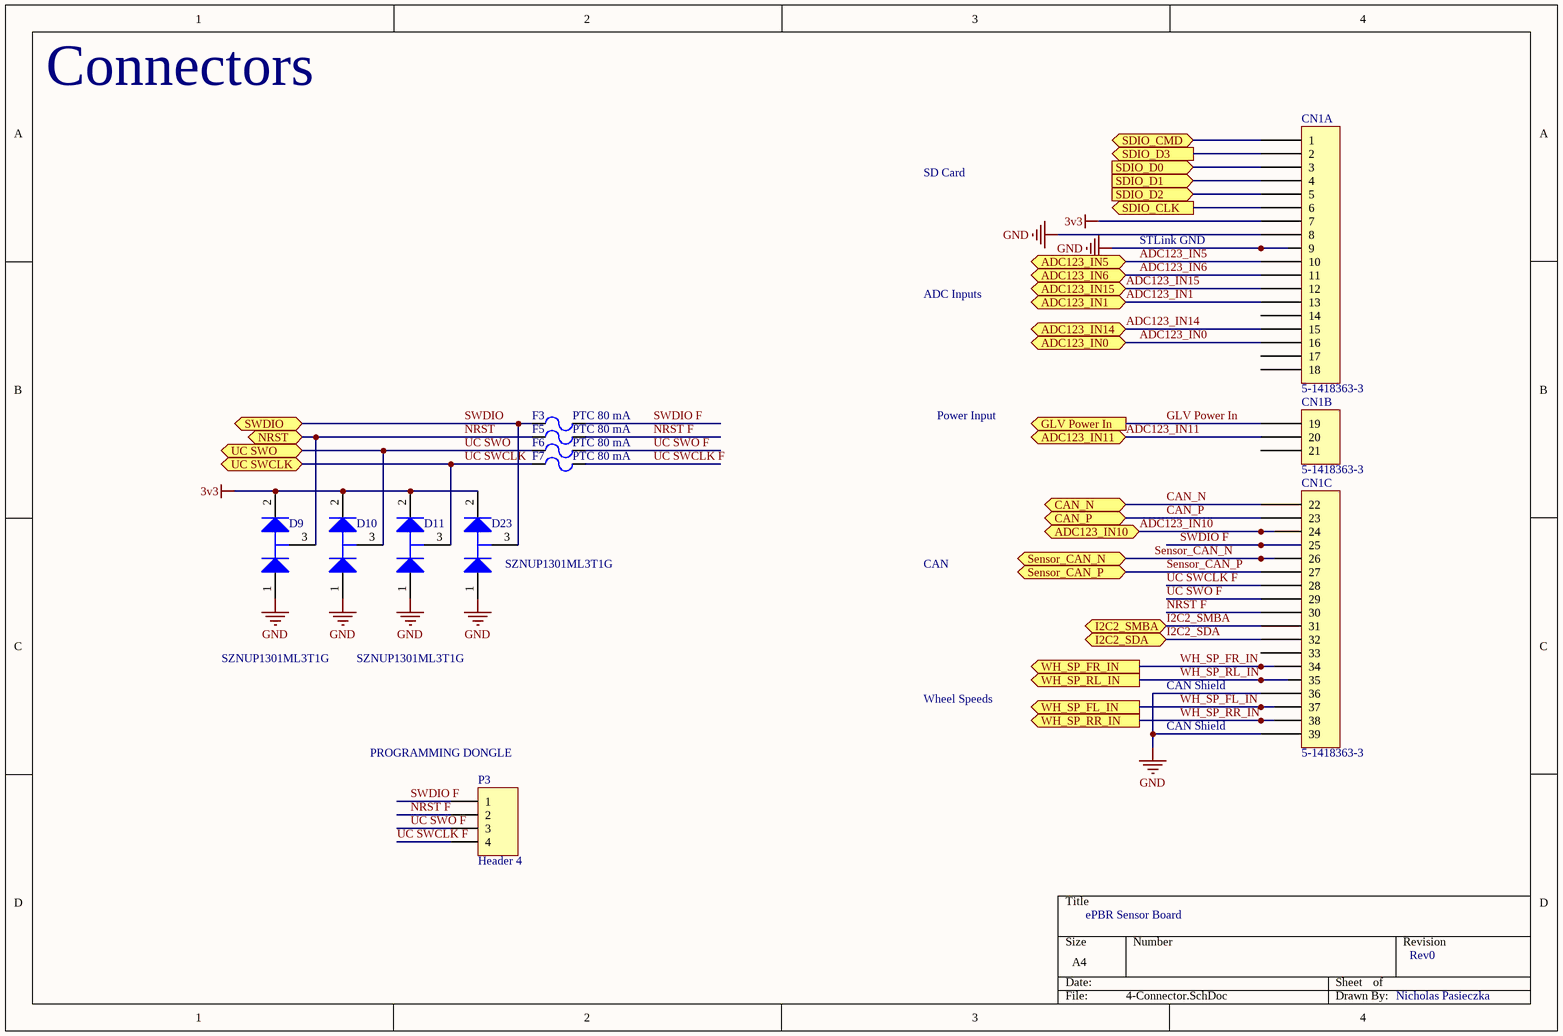
[diagram p3: 4-Connector.SchDoc]

### Parts
CN1  5-1418363-3  [5-1418363-3]  (parts A,B,C of 3)
D9  SZNUP1301ML3T1G  [ONSC-SOT-23-3-318-08_V]
D10  SZNUP1301ML3T1G  [ONSC-SOT-23-3-318-08_V]  (value not drawn)
D11  SZNUP1301ML3T1G  [ONSC-SOT-23-3-318-08_V]
D23  SZNUP1301ML3T1G  [ONSC-SOT-23-3-318-08_V]
F3  PTC 80 mA  [0603 fuse]
F5  PTC 80 mA  [0603 fuse]
F6  PTC 80 mA  [0603 fuse]
F7  PTC 80 mA  [0603 fuse]
P3  Header 4  [HDR1X4]

### Ports
ADC123_IN0 (bidir), ADC123_IN1 (bidir), ADC123_IN5 (bidir), ADC123_IN6 (bidir), ADC123_IN10 (bidir), ADC123_IN11 (bidir), ADC123_IN14 (bidir), ADC123_IN15 (bidir), CAN_N (bidir), CAN_P (bidir), GLV Power In (out), I2C2_SDA (bidir), I2C2_SMBA (bidir), NRST (bidir), SDIO_CLK (out), SDIO_CMD (bidir), SDIO_D0 (in), SDIO_D1 (in), SDIO_D2 (in), SDIO_D3 (out), Sensor_CAN_N (bidir), Sensor_CAN_P (bidir), SWDIO (bidir), UC SWCLK (bidir), UC SWO (bidir), WH_SP_FL_IN (out), WH_SP_FR_IN (out), WH_SP_RL_IN (out), WH_SP_RR_IN (out)

### Nets
3v3: CN1.7 D9.2(K) D10.2(K) D11.2(K) D23.2(K)
GND: CN1.8 CN1.9 CN1.36 CN1.39 D9.1(A) D10.1(A) D11.1(A) D23.1(A)
ADC123_IN0: CN1.16 ; port ADC123_IN0
ADC123_IN1: CN1.13 ; port ADC123_IN1
ADC123_IN5: CN1.10 ; port ADC123_IN5
ADC123_IN6: CN1.11 ; port ADC123_IN6
ADC123_IN10: CN1.24 ; port ADC123_IN10
ADC123_IN11: CN1.20 ; port ADC123_IN11
ADC123_IN14: CN1.15 ; port ADC123_IN14
ADC123_IN15: CN1.12 ; port ADC123_IN15
CAN_N: CN1.22 ; port CAN_N
CAN_P: CN1.23 ; port CAN_P
GLV Power In: CN1.19 ; port GLV Power In
I2C2_SDA: CN1.32 ; port I2C2_SDA
I2C2_SMBA: CN1.31 ; port I2C2_SMBA
NRST: D9.3(K/A) F5.1 ; port NRST
NRST F: CN1.30 F5.2 P3.2
Sensor_CAN_N: CN1.26 ; port Sensor_CAN_N
Sensor_CAN_P: CN1.27 ; port Sensor_CAN_P
SWDIO: D23.3(K/A) F3.1 ; port SWDIO
SWDIO F: CN1.25 F3.2 P3.1
UC SWCLK: D11.3(K/A) F7.1 ; port UC SWCLK
UC SWCLK F: CN1.28 F7.2 P3.4
UC SWO: D10.3(K/A) F6.1 ; port UC SWO
UC SWO F: CN1.29 F6.2 P3.3
WH_SP_FL_IN: CN1.37 ; port WH_SP_FL_IN
WH_SP_FR_IN: CN1.34 ; port WH_SP_FR_IN
WH_SP_RL_IN: CN1.35 ; port WH_SP_RL_IN
WH_SP_RR_IN: CN1.38 ; port WH_SP_RR_IN
NetCN1_1: CN1.1 ; port SDIO_CMD
NetCN1_2: CN1.2 ; port SDIO_D3
NetCN1_3: CN1.3 ; port SDIO_D0
NetCN1_4: CN1.4 ; port SDIO_D1
NetCN1_5: CN1.5 ; port SDIO_D2
NetCN1_6: CN1.6 ; port SDIO_CLK

Not connected (* = marked no-connect by the designer): CN1 14 17 18 21 33

### Notes on the sheet
- Connectors
- SD Card
- STLink GND
- ADC Inputs
- Power Input
- CAN
- Wheel Speeds
- CAN Shield
- (near P3) PROGRAMMING DONGLE
- ePBR Sensor Board
- Rev0
- Nicholas Pasieczka

### Library data of the parts
CN1 = 5-1418363-3: Levyseal 90 degree 39 pin header
D9-D11 D23 = CMP-1063-00171-1: Low Capacitance Diode Array for ESD Protection in a Single Data Line, 3-Pin SOT-23, Pb-Free, Tape and Reel; Manufacturer: On Semiconductor; C Max (pF): 0.9; Direction: Bidirectional; V(BR) Min (V): 70; Number of Lines: 1; Mounting Technology: Surface Mount; PackageReference: SOT-23-3-318-08; DatasheetVersion: Rev. 6; PackageVersion: Rev. AP, 11/2009; RoHS: Pb-Free; ComponentLink1Description: Manufacturer URL; ComponentLink1URL: http://www.onsemi.com/; PackageDescription: 3-Pin Small Outline Transistor, Body 2.92 x 1.3 mm, Pitch 0.95 mm; PartNumber: SZNUP1301ML3T1G; Packing: Tape and Reel; ComponentLink3URL: http://www.onsemi.cn/pub_link/Collateral/318-08.PDF; ComponentLink3Description: Package Specification; VRWM Max (V): 70; ComponentLink2Description: Datasheet; ComponentLink2URL: http://www.onsemi.cn/pub_link/Collateral/NUP1301ML3T1-D.PDF; Supplier 1: Mouser; Supplier Part Number 1: 863-SZNUP1301ML3T1G
F3 F5-F7 = PTC fuse 80mA 0ZCM0008FF2G: 0ZCM0008FF2G; Supplier 1: Digi-Key; Supplier Part Number 1: 507-1817-1-ND
P3 = Header 4: Header, 4-Pin; LatestRevisionDate: 17-Jul-2002; LatestRevisionNote: Re-released for DXP Platform.; Publisher: Altium Limited

## Sheet 5-LORA.SchDoc
size A4
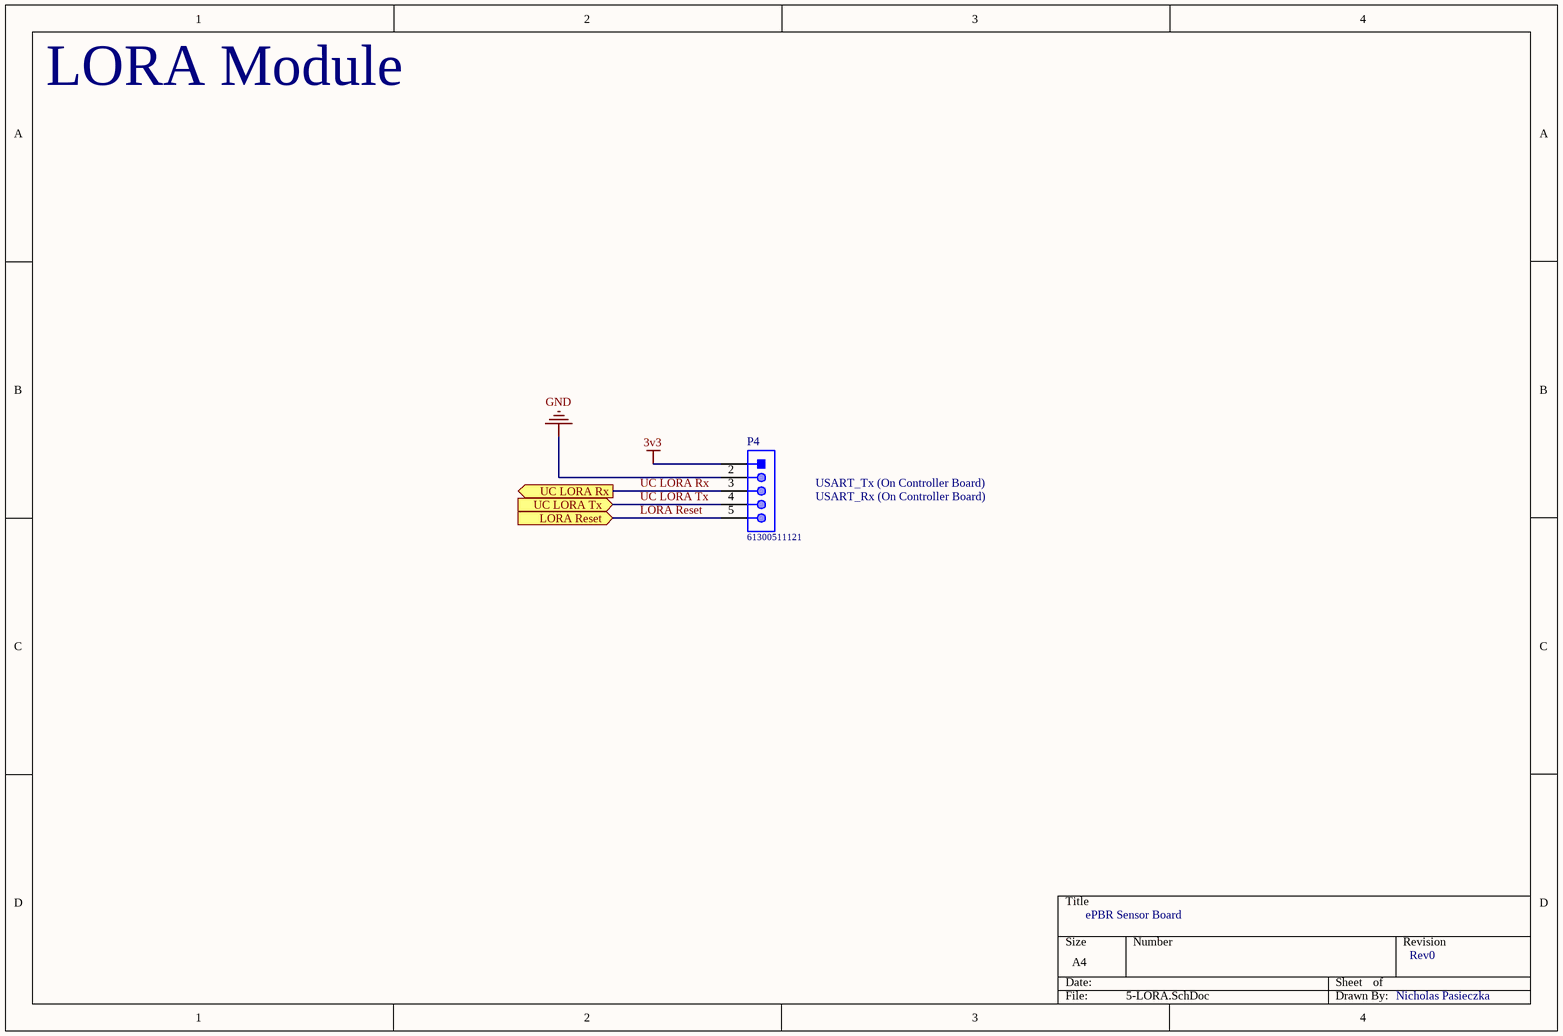
[diagram p4: 5-LORA.SchDoc]

### Parts
P4  61300511121  [61300511121]

### Ports
LORA Reset (in), UC LORA Rx (out), UC LORA Tx (in)

### Nets
3v3: P4.1
GND: P4.2
LORA Reset: P4.5 ; port LORA Reset
UC LORA Rx: P4.3 ; port UC LORA Rx
UC LORA Tx: P4.4 ; port UC LORA Tx

### Notes on the sheet
- LORA Module
- USART_Tx (On Controller Board)
- USART_Rx (On Controller Board)
- ePBR Sensor Board
- Rev0
- Nicholas Pasieczka

### Library data of the parts
P4 = CMP-1502-01068-1: THT Vertical Pin Header WR-PHD, Pitch 2.54 mm, Single Row, 5 pins; Manufacturer: Wurth Elektronik; Pin Number: 5; Contact Resistance: 20mOhm; Working Voltage: 250VAC; Pitch: 2.54mm; Withstanding Voltage: 500VAC; Rated Current: 3A; Gender: Male; Datasheet URL: https://katalog.we-online.de/em/datasheet/6130xx11121.pdf; Orientation: Vertical; Mounting Technology: THT; Row Number: Single; Package Reference: 61300511121; Publisher: WurthElektronik; Part Number: 61300511121; Packaging: Bag; Manufacturer URL: http://www.we-online.de; Operating Temperature: -40to105degC

## Sheet 6-Sensors.SchDoc
size A4
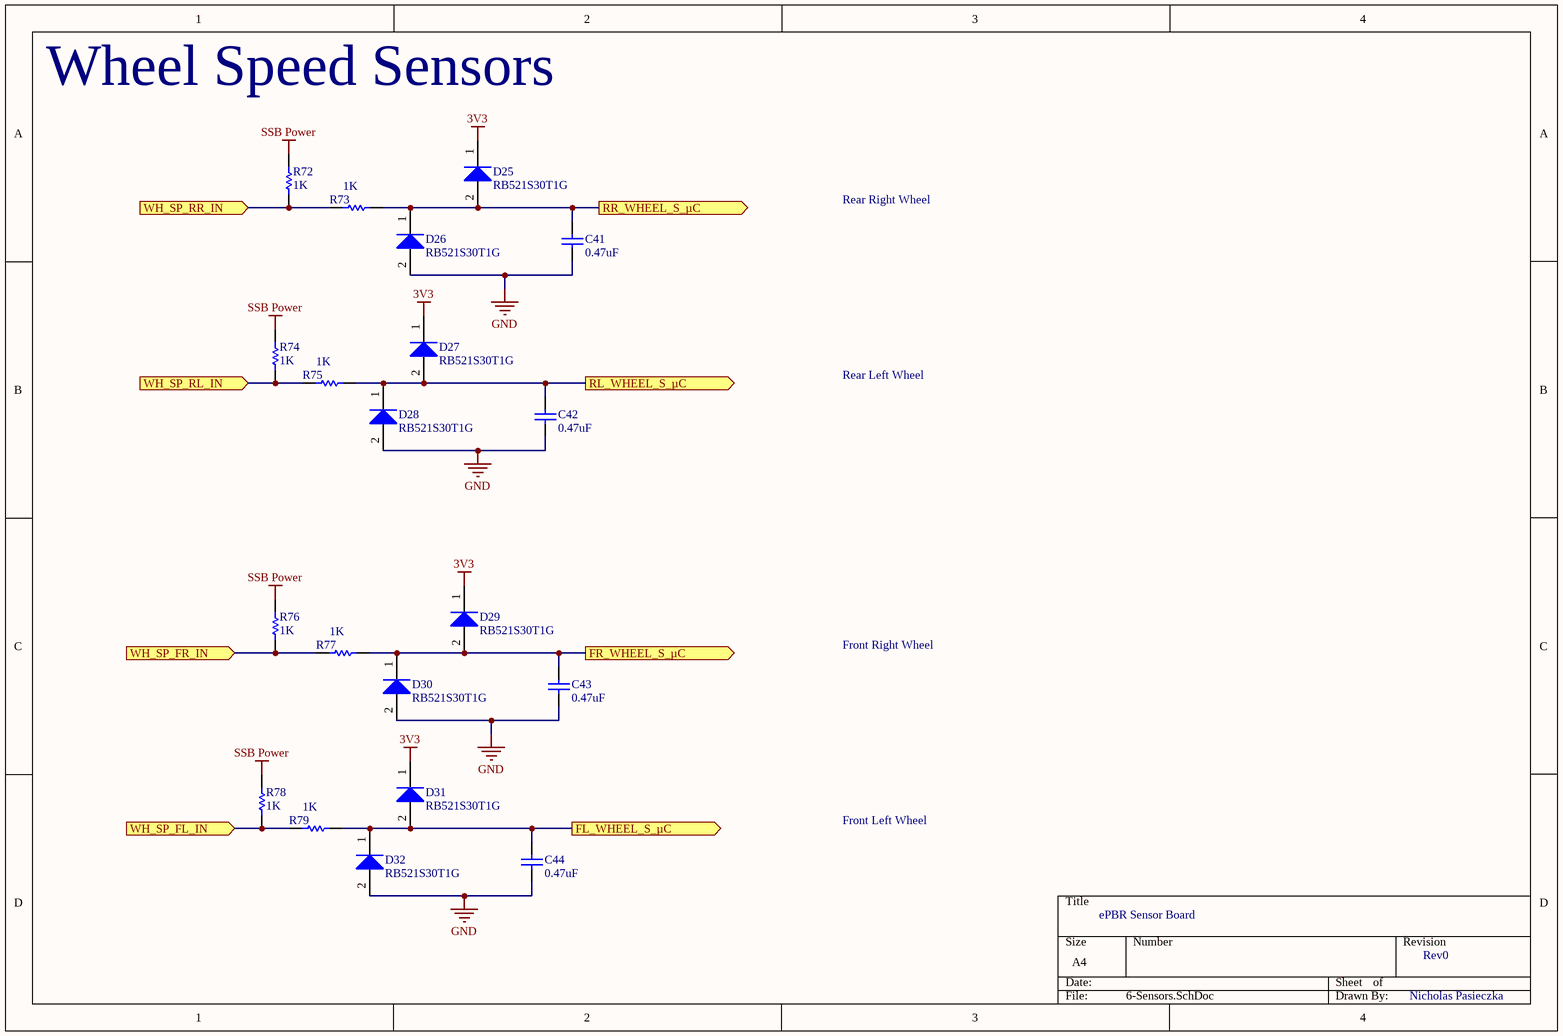
[diagram p5: 6-Sensors.SchDoc]

### Parts
C41  value 0.47uF  [1608[0603]]  (hidden comment: Cap)
C42  value 0.47uF  [1608[0603]]  (hidden comment: Cap)
C43  value 0.47uF  [1608[0603]]  (hidden comment: Cap)
C44  value 0.47uF  [1608[0603]]  (hidden comment: Cap)
D25  RB521S30T1G  [ONSC-SOD-523-2-502-01_V]
D26  RB521S30T1G  [ONSC-SOD-523-2-502-01_V]
D27  RB521S30T1G  [ONSC-SOD-523-2-502-01_V]
D28  RB521S30T1G  [ONSC-SOD-523-2-502-01_V]
D29  RB521S30T1G  [ONSC-SOD-523-2-502-01_V]
D30  RB521S30T1G  [ONSC-SOD-523-2-502-01_V]
D31  RB521S30T1G  [ONSC-SOD-523-2-502-01_V]
D32  RB521S30T1G  [ONSC-SOD-523-2-502-01_V]
R72  value 1K  [1608[0603]]  (hidden comment: Res1)
R73  value 1K  [1608[0603]]  (hidden comment: Res1)
R74  value 1K  [1608[0603]]  (hidden comment: Res1)
R75  value 1K  [1608[0603]]  (hidden comment: Res1)
R76  value 1K  [1608[0603]]  (hidden comment: Res1)
R77  value 1K  [1608[0603]]  (hidden comment: Res1)
R78  value 1K  [1608[0603]]  (hidden comment: Res1)
R79  value 1K  [1608[0603]]  (hidden comment: Res1)

### Ports
FL_WHEEL_S_µC (out), FR_WHEEL_S_µC (out), RL_WHEEL_S_µC (out), RR_WHEEL_S_µC (out), WH_SP_FL_IN (in), WH_SP_FR_IN (in), WH_SP_RL_IN (in), WH_SP_RR_IN (in)

### Nets
3v3: D25.1(K) D27.1(K) D29.1(K) D31.1(K)
GND: C41.1 C42.1 C43.1 C44.1 D26.2(A) D28.2(A) D30.2(A) D32.2(A)
SSB Power: R72.2 R74.2 R76.2 R78.2
FL_WHEEL_S_µC: C44.2 D31.2(A) D32.1(K) R79.2 ; port FL_WHEEL_S_µC
FR_WHEEL_S_µC: C43.2 D29.2(A) D30.1(K) R77.2 ; port FR_WHEEL_S_µC
RL_WHEEL_S_µC: C42.2 D27.2(A) D28.1(K) R75.2 ; port RL_WHEEL_S_µC
RR_WHEEL_S_µC: C41.2 D25.2(A) D26.1(K) R73.2 ; port RR_WHEEL_S_µC
WH_SP_FL_IN: R78.1 R79.1 ; port WH_SP_FL_IN
WH_SP_FR_IN: R76.1 R77.1 ; port WH_SP_FR_IN
WH_SP_RL_IN: R74.1 R75.1 ; port WH_SP_RL_IN
WH_SP_RR_IN: R72.1 R73.1 ; port WH_SP_RR_IN

### Notes on the sheet
- Wheel Speed Sensors
- Rear Right Wheel
- Rear Left Wheel
- Front Right Wheel
- Front Left Wheel
- ePBR Sensor Board
- Rev0
- Nicholas Pasieczka

### Library data of the parts
C41-C44 = Cap: Capacitor; Published: 8-Jun-2000; LatestRevisionDate: 17-Jul-2002; LatestRevisionNote: Re-released for DXP Platform.; PackageReference: RAD-0.3; Publisher: Altium Limited; PackageDescription: Radial Cap, Thru-Hole; 2 Leads; 0.3 in Pin Spacing
D25-D32 = CMP-1051-00018-1: Schottky Barrier Diode, 2-Pin SOD-523, Pb-Free, Tape and Reel; Manufacturer: On Semiconductor; Configuration: Single; IFSM Max (A): 1; Mounting Technology: Surface Mount; ComponentLink1Description: Manufacturer URL; PackageReference: SOD-523-2-502-01; RoHS: TRUE; ComponentLink3Description: Package Specification; ComponentLink2Description: Datasheet; PackageVersion: Rev. E, 09/2010; PartNumber: RB521S30T1G; ComponentLink3URL: http://www.onsemi.com/pub_link/Collateral/502-01.PDF; ComponentLink1URL: http://www.onsemi.com/; PackageDescription: 2-Pin SOD, Body 1.2 x 0.8 mm; DatasheetVersion: Rev. 8; ComponentLink2URL: http://www.onsemi.cn/pub_link/Collateral/RB521S30T1-D.PDF; Packing: Tape and Reel
R72-R79 = Res1: Resistor; Published: 8-Jun-2000; LatestRevisionDate: 17-Jul-2002; LatestRevisionNote: Re-released for DXP Platform.; PackageReference: AXIAL-0.3; Publisher: Altium Limited; PackageDescription: Axial Device, Thru-Hole; 2 Leads; 0.3 in Pin Spacing

## Sheet 7-Fusing.SchDoc
size A4
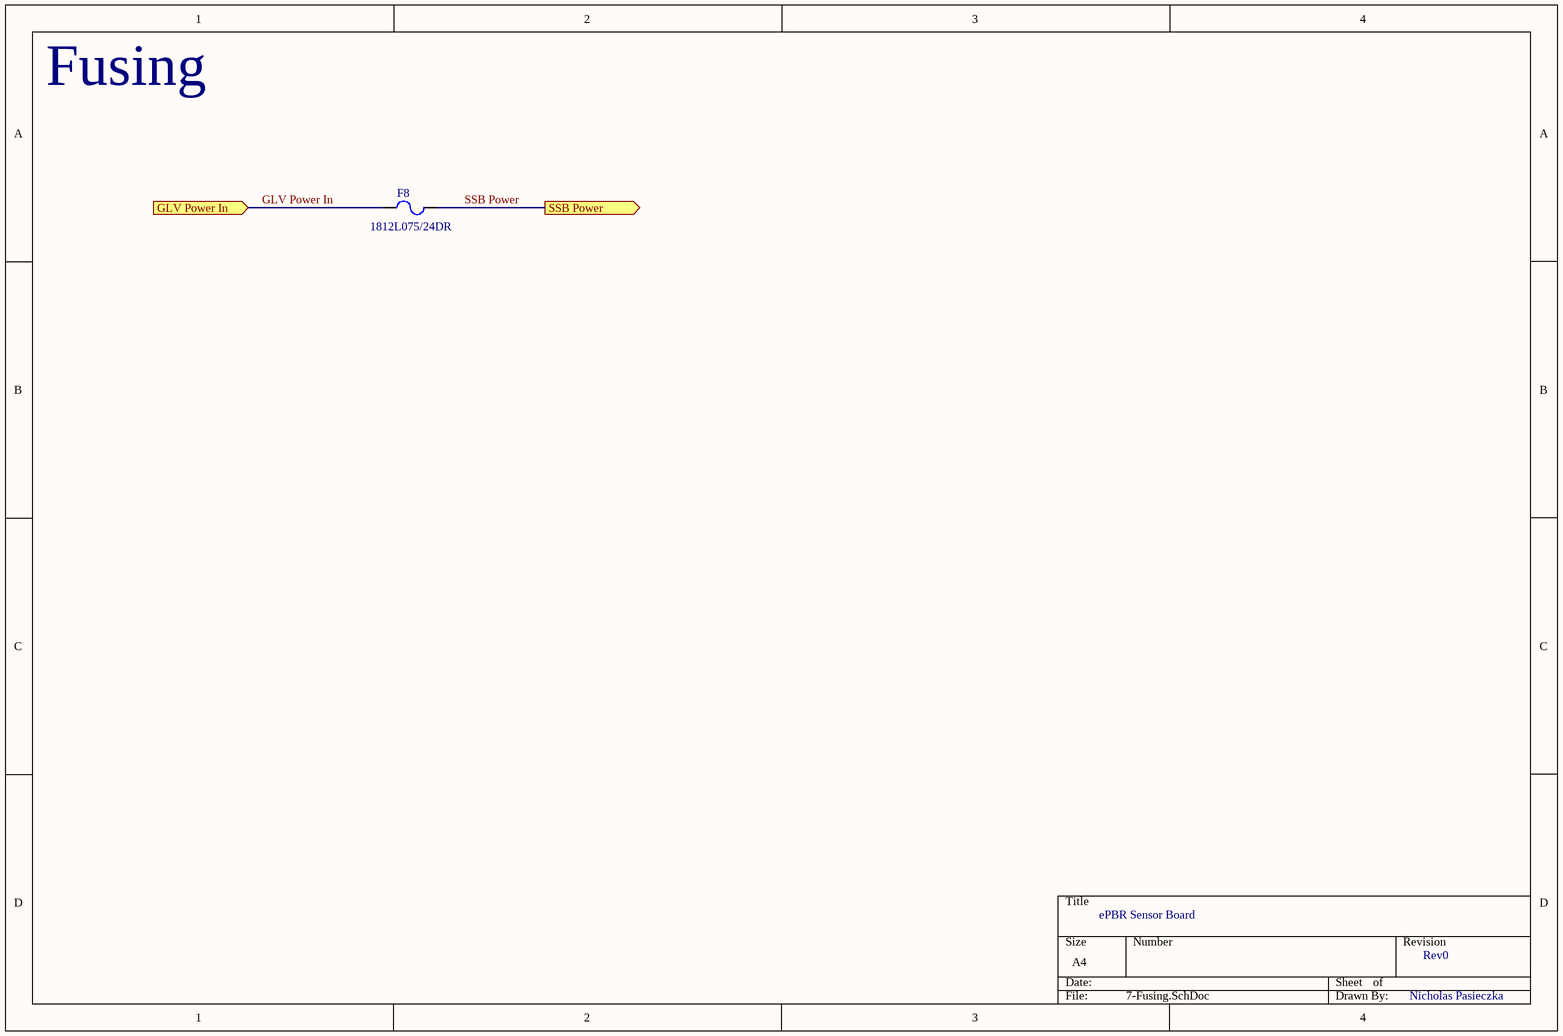
[diagram p6: 7-Fusing.SchDoc]

### Parts
F8  1812L075/24DR  [LFUS-1812L07524DR_V]

### Ports
GLV Power In (in), SSB Power (out)

### Nets
SSB Power: F8.2 ; port SSB Power
GLV Power In: F8.1 ; port GLV Power In

### Notes on the sheet
- Fusing
- ePBR Sensor Board
- Rev0
- Nicholas Pasieczka

### Library data of the parts
F8 = CMP-2000-05510-1: Poly-Fuse(R) Resettable PTC, 24 V, 100 A, -40 to 85 degC, 2-Pin SMD, RoHS, Tape and Reel; Manufacturer: Littelfuse; Resistance: 290mOhms; Current Rating - Max: 100A; Maximum Voltage: 24VDC; Hold Current: 0.75A; Trip Current: 1.5A; Maximum Voltage DC: 24V; Type: PolyFuseResettablePTC; Datasheet Version: 02/2016; Package / Case: 1812(4532metric); Mounting Technology: SurfaceMount; Packaging: Reel; Package Description: 2-Pin Surface Mount Device, Body 4.55 x 3.24 mm; Brand: Littelfuse; Manufacturer URL: http://www.littelfuse.com/; Mounting Style: SMD/SMT; Dimensions: 4.37mmLx3.07mmWx0.75mmH; Operating Temperature Range: -40Cto+85C; Product Category: ResettableFuses-PPTC; Current Rating: 100A; Termination Style: SMD/SMT; Factory Pack Quantity: 1500; Current Rating (Max): 100A; Package Reference: 1812L07524DR; RoHS: Details; Series: 1812L; Datasheet URL: http://www.littelfuse.com/~/media/electronics/datasheets/resettable_ptcs/littelfuse_ptc_1812l_datasheet.pdf.pdf

## Sheet 8-Other_Inputs.SchDoc
size A4
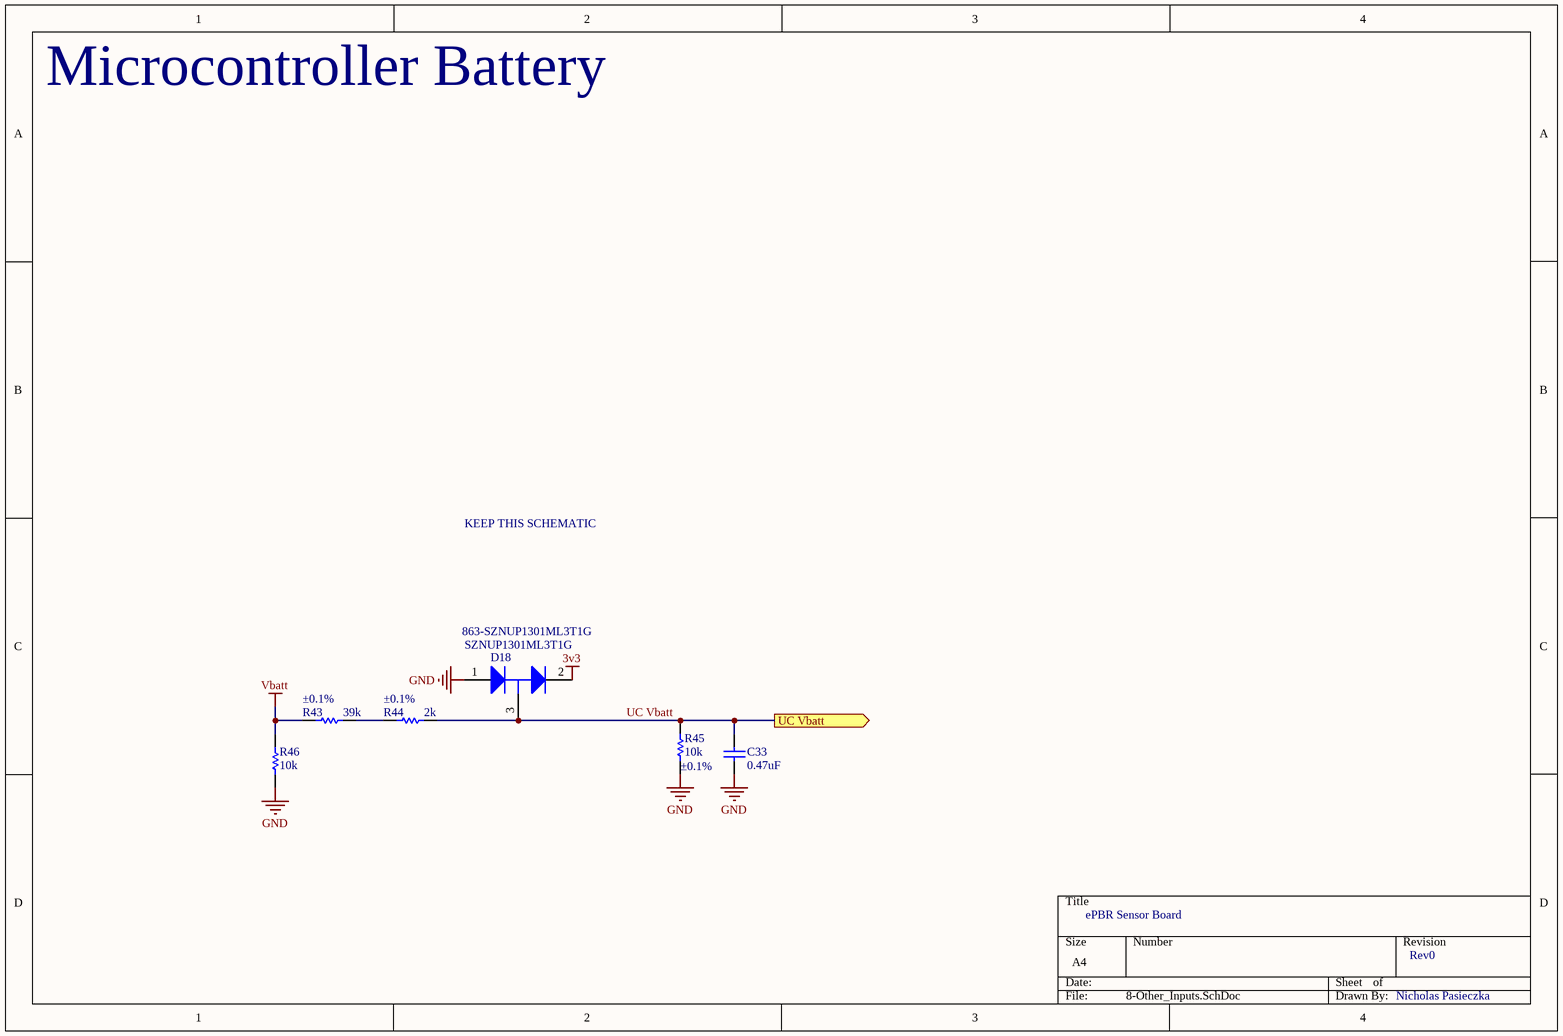
[diagram p7: 8-Other_Inputs.SchDoc]

### Parts
C33  value 0.47uF  [1608[0603]]  (hidden comment: Cap)
D18  SZNUP1301ML3T1G  Supplier Part Number 1: 863-SZNUP1301ML3T1G  [ONSC-SOT-23-3-318-08_V]
R43  value 39k  Tolerance: ±0.1%  [1608[0603]]  (hidden comment: Res1)
R44  value 2k  Tolerance: ±0.1%  [1608[0603]]  (hidden comment: Res1)
R45  value 10k  Tolerance: ±0.1%  [1608[0603]]  (hidden comment: Res1)
R46  value 10k  [1608[0603]]  (hidden comment: Res1)

### Ports
UC Vbatt (out)

### Nets
3v3: D18.2(K)
GND: C33.1 D18.1(A) R45.1 R46.1
Vbatt: R43.1 R46.2
UC Vbatt: C33.2 D18.3(K/A) R44.2 R45.2 ; port UC Vbatt
NetR43_2: R43.2 R44.1

### Notes on the sheet
- Microcontroller Battery
- KEEP THIS SCHEMATIC
- ePBR Sensor Board
- Rev0
- Nicholas Pasieczka

### Library data of the parts
C33 = Cap: Capacitor; Manufacturer: Yageo; Manufacturer Part Number: CC0603KRX7R8BB474; Capacitance: 0.47µF; Tolerance: ±10%; Voltage - Rated: 25V; Temperature Coefficient: X7R; Supplier 1: Digi-Key; Supplier Part Number 1: 311-1805-1-ND; RoHS: RoHS Compliant; Category: Capacitors; Stock 1: 11076; Pricing 1: 1=0.22, 10=0.158, 25=0.1156, 50=0.0898, 100=0.0745, 250=0.06168, 500=0.05226, 1000=0.04324 (CAD); Packaging: Cut Tape (CT); Part Status: Active; Operating Temperature: -55°C ~ 125°C; Features: -; Ratings: -; Applications: General Purpose; Failure Rate: -; Mounting Type: Surface Mount, MLCC; Package / Case: 0603 (1608 Metric); Size / Dimension: 0.063" L x 0.031" W (1.60mm x 0.80mm); Height - Seated (Max): -; Thickness (Max): 0.035" (0.90mm); Lead Spacing: -; Lead Style: -; ComponentLink1URL: http://www.yageo.com/documents/recent/UPY-GPHC_X7R_6.3V-to-50V_16.pdf; ComponentLink1Description: http://www.yageo.com/documents/recent/UPY-GPHC_X7R_6.3V-to-50V_16.pdf
D18 = CMP-1063-00171-1: as D9 on sheet 4-Connector; Mounting Technology: Surface Mount; PackageReference: SOT-23-3-318-08; DatasheetVersion: Rev. 6; PackageVersion: Rev. AP, 11/2009; RoHS: Pb-Free; ComponentLink1Description: Manufacturer URL; ComponentLink1URL: http://www.onsemi.com/; PackageDescription: 3-Pin Small Outline Transistor, Body 2.92 x 1.3 mm, Pitch 0.95 mm; PartNumber: SZNUP1301ML3T1G; Packing: Tape and Reel; ComponentLink3URL: http://www.onsemi.cn/pub_link/Collateral/318-08.PDF; ComponentLink3Description: Package Specification; VRWM Max (V): 70; ComponentLink2Description: Datasheet; ComponentLink2URL: http://www.onsemi.cn/pub_link/Collateral/NUP1301ML3T1-D.PDF; Supplier 1: Mouser
R43 = Res1: Resistor; Manufacturer: Yageo; Manufacturer Part Number: RT0603BRD0739KL; Power (Watts): 0.1W, 1/10W; Temperature Coefficient: ±25ppm/°C; Supplier 1: Digi-Key; Supplier Part Number 1: YAG1649CT-ND; RoHS: RoHS Compliant; Category: Resistors; Stock 1: 2740; Pricing 1: 1=0.55, 10=0.464, 25=0.3376, 50=0.2446, 100=0.1814, 250=0.1392, 500=0.10966, 1000=0.07592 (CAD); Packaging: Cut Tape (CT); Part Status: Active; Resistance (Ohms): 39k; Composition: Thin Film; Features: Moisture Resistant; Operating Temperature: -55°C ~ 155°C; Package / Case: 0603 (1608 Metric); Supplier Device Package: 0603; Size / Dimension: 0.063" L x 0.031" W (1.60mm x 0.80mm); Height - Seated (Max): 0.022" (0.55mm); Number of Terminations: 2; Failure Rate: -; ComponentLink1URL: http://www.yageo.com/documents/recent/PYu-RT_1-to-0.05_RoHS_L_6.pdf; ComponentLink1Description: http://www.yageo.com/documents/recent/PYu-RT_1-to-0.05_RoHS_L_6.pdf
R44 = Res1: Resistor; Manufacturer: Yageo; Manufacturer Part Number: AT0603BRD072KL; Power (Watts): 0.1W, 1/10W; Temperature Coefficient: ±25ppm/°C; Supplier 1: Digi-Key; Supplier Part Number 1: YAG2112CT-ND; RoHS: RoHS Compliant; Category: Resistors; Stock 1: 1218; Pricing 1: 1=0.59, 10=0.431, 25=0.3188, 50=0.235, 100=0.1725, 250=0.14248, 500=0.11746, 1000=0.08498 (CAD); Packaging: Cut Tape (CT); Part Status: Active; Resistance (Ohms): 2k; Composition: Thin Film; Features: Anti-Sulfur, Automotive AEC-Q200, Moisture Resistant; Operating Temperature: -55°C ~ 155°C; Package / Case: 0603 (1608 Metric); Supplier Device Package: 0603; Size / Dimension: 0.063" L x 0.032" W (1.60mm x 0.80mm); Height - Seated (Max): 0.022" (0.55mm); Number of Terminations: 2; Failure Rate: -; ComponentLink1URL: http://www.yageo.com/documents/recent/PYu-AT_51_RoHS_L-3.pdf; ComponentLink1Description: http://www.yageo.com/documents/recent/PYu-AT_51_RoHS_L-3.pdf
R45 = Res1: Resistor; Manufacturer: Yageo; Manufacturer Part Number: RT0603BRD0710KL; Power (Watts): 0.1W, 1/10W; Temperature Coefficient: ±25ppm/°C; Supplier 1: Digi-Key; Supplier Part Number 1: YAG1236CT-ND; RoHS: RoHS Compliant; Category: Resistors; Stock 1: 2958; Pricing 1: 1=0.5, 10=0.42, 25=0.3048, 50=0.2212, 100=0.164, 250=0.12592, 500=0.0992, 1000=0.06867 (CAD); Packaging: Cut Tape (CT); Part Status: Active; Resistance (Ohms): 10k; Composition: Thin Film; Features: Moisture Resistant; Operating Temperature: -55°C ~ 155°C; Package / Case: 0603 (1608 Metric); Supplier Device Package: 0603; Size / Dimension: 0.063" L x 0.031" W (1.60mm x 0.80mm); Height - Seated (Max): 0.022" (0.55mm); Number of Terminations: 2; Failure Rate: -; ComponentLink1URL: http://www.yageo.com/documents/recent/PYu-RT_1-to-0.05_RoHS_L_6.pdf; ComponentLink1Description: http://www.yageo.com/documents/recent/PYu-RT_1-to-0.05_RoHS_L_6.pdf
R46 = Res1: Resistor; Manufacturer: Yageo; Manufacturer Part Number: RC0603JR-0710KL; Tolerance: ±5%; Power (Watts): 0.1W, 1/10W; Temperature Coefficient: ±100ppm/°C; Supplier 1: Digi-Key; Supplier Part Number 1: 311-10KGRCT-ND; RoHS: RoHS Compliant; Category: Resistors; Stock 1: 2936292; Pricing 1: 1=0.16, 10=0.016, 25=0.0112, 50=0.0084, 100=0.0062, 250=0.0048, 500=0.00382, 1000=0.00281 (CAD); Packaging: Cut Tape (CT); Part Status: Active; Resistance (Ohms): 10k; Composition: Thick Film; Features: Moisture Resistant; Operating Temperature: -55°C ~ 155°C; Package / Case: 0603 (1608 Metric); Supplier Device Package: 0603; Size / Dimension: 0.063" L x 0.031" W (1.60mm x 0.80mm); Height - Seated (Max): 0.022" (0.55mm); Number of Terminations: 2; Failure Rate: -; ComponentLink1URL: http://www.yageo.com/NewPortal/yageodocoutput?fileName=/pdf/R-Chip/PYu-RC_Group_51_RoHS_L_4.pdf; ComponentLink1Description: http://www.yageo.com/NewPortal/yageodocoutput?fileName=/pdf/R-Chip/PYu-RC_Group_51_RoHS_L_4.pdf

## Nets that join several sheets
3v3: 1-Controller (15 pins), 2-Power (C18.2 R7.1 REG2.3), 3-CAN (C19.2 C24.2 U2.3 U3.3), 4-Connector (5 pins), 5-LORA (P4.1), 6-Sensors (D25.1 D27.1 D29.1 D31.1), 8-Other_Inputs (D18.2)
3v3Ref: 1-Controller (C3.2 U1.21), 2-Power (C11.2 Ref1.6)
GND: 1-Controller (23 pins), 2-Power (15 pins), 3-CAN (6 pins), 4-Connector (8 pins), 5-LORA (P4.2), 6-Sensors (8 pins), 8-Other_Inputs (C33.1 D18.1 R45.1 R46.1)
SSB Power: 2-Power (Q1.3), 6-Sensors (R72.2 R74.2 R76.2 R78.2), 7-Fusing (F8.2)
Vbatt: 2-Power (10 pins), 8-Other_Inputs (R43.1 R46.2)
ADC123_IN0: 1-Controller (U1.23), 4-Connector (CN1.16)
ADC123_IN1: 1-Controller (U1.24), 4-Connector (CN1.13)
ADC123_IN5: 1-Controller (U1.30), 4-Connector (CN1.10)
ADC123_IN6: 1-Controller (U1.31), 4-Connector (CN1.11)
ADC123_IN10: 1-Controller (U1.15), 4-Connector (CN1.24)
ADC123_IN11: 1-Controller (U1.16), 4-Connector (CN1.20)
ADC123_IN14: 1-Controller (U1.33), 4-Connector (CN1.15)
ADC123_IN15: 1-Controller (U1.34), 4-Connector (CN1.12)
CAN Rx: 1-Controller (U1.95), 3-CAN (R9.2)
CAN Tx: 1-Controller (U1.96), 3-CAN (R10.2)
CAN_N: 3-CAN (D4.2 R11.1 U2.6), 4-Connector (CN1.22)
CAN_P: 3-CAN (D4.1 R11.2 U2.7), 4-Connector (CN1.23)
FL_WHEEL_S_µC: 1-Controller (U1.85), 6-Sensors (C44.2 D31.2 D32.1 R79.2)
FR_WHEEL_S_µC: 1-Controller (U1.84), 6-Sensors (C43.2 D29.2 D30.1 R77.2)
GLV Power In: 4-Connector (CN1.19), 7-Fusing (F8.1)
I2C2_SDA: 1-Controller (U1.80), 4-Connector (CN1.32)
I2C2_SMBA: 1-Controller (U1.51), 4-Connector (CN1.31)
LORA Reset: 1-Controller (U1.57), 5-LORA (P4.5)
NetCN1_1: 1-Controller (U1.83), 4-Connector (CN1.1)
NetCN1_2: 1-Controller (U1.79), 4-Connector (CN1.2)
NetCN1_3: 1-Controller (U1.65), 4-Connector (CN1.3)
NetCN1_4: 1-Controller (U1.35), 4-Connector (CN1.4)
NetCN1_5: 1-Controller (U1.36), 4-Connector (CN1.5)
NetCN1_6: 1-Controller (U1.37), 4-Connector (CN1.6)
NRST: 1-Controller (C1.2 U1.14), 4-Connector (D9.3 F5.1)
RL_WHEEL_S_µC: 1-Controller (U1.82), 6-Sensors (C42.2 D27.2 D28.1 R75.2)
RR_WHEEL_S_µC: 1-Controller (U1.81), 6-Sensors (C41.2 D25.2 D26.1 R73.2)
Sensor CAN Rx: 1-Controller (U1.91), 3-CAN (R28.2)
Sensor CAN Tx: 1-Controller (U1.92), 3-CAN (R29.2)
Sensor_CAN_N: 3-CAN (D21.2 R30.1 U3.6), 4-Connector (CN1.26)
Sensor_CAN_P: 3-CAN (D21.1 R30.2 U3.7), 4-Connector (CN1.27)
SWDIO: 1-Controller (U1.72), 4-Connector (D23.3 F3.1)
UC LORA Rx: 1-Controller (U1.55), 5-LORA (P4.3)
UC LORA Tx: 1-Controller (U1.56), 5-LORA (P4.4)
UC SWCLK: 1-Controller (U1.76), 4-Connector (D11.3 F7.1)
UC SWO: 1-Controller (U1.89), 4-Connector (D10.3 F6.1)
UC Vbatt: 1-Controller (U1.32), 8-Other_Inputs (C33.2 D18.3 R44.2 R45.2)
WH_SP_FL_IN: 4-Connector (CN1.37), 6-Sensors (R78.1 R79.1)
WH_SP_FR_IN: 4-Connector (CN1.34), 6-Sensors (R76.1 R77.1)
WH_SP_RL_IN: 4-Connector (CN1.35), 6-Sensors (R74.1 R75.1)
WH_SP_RR_IN: 4-Connector (CN1.38), 6-Sensors (R72.1 R73.1)